# EAGLE design range_cape (EAGLE 7.3.0)

## Sheet 1 of 5
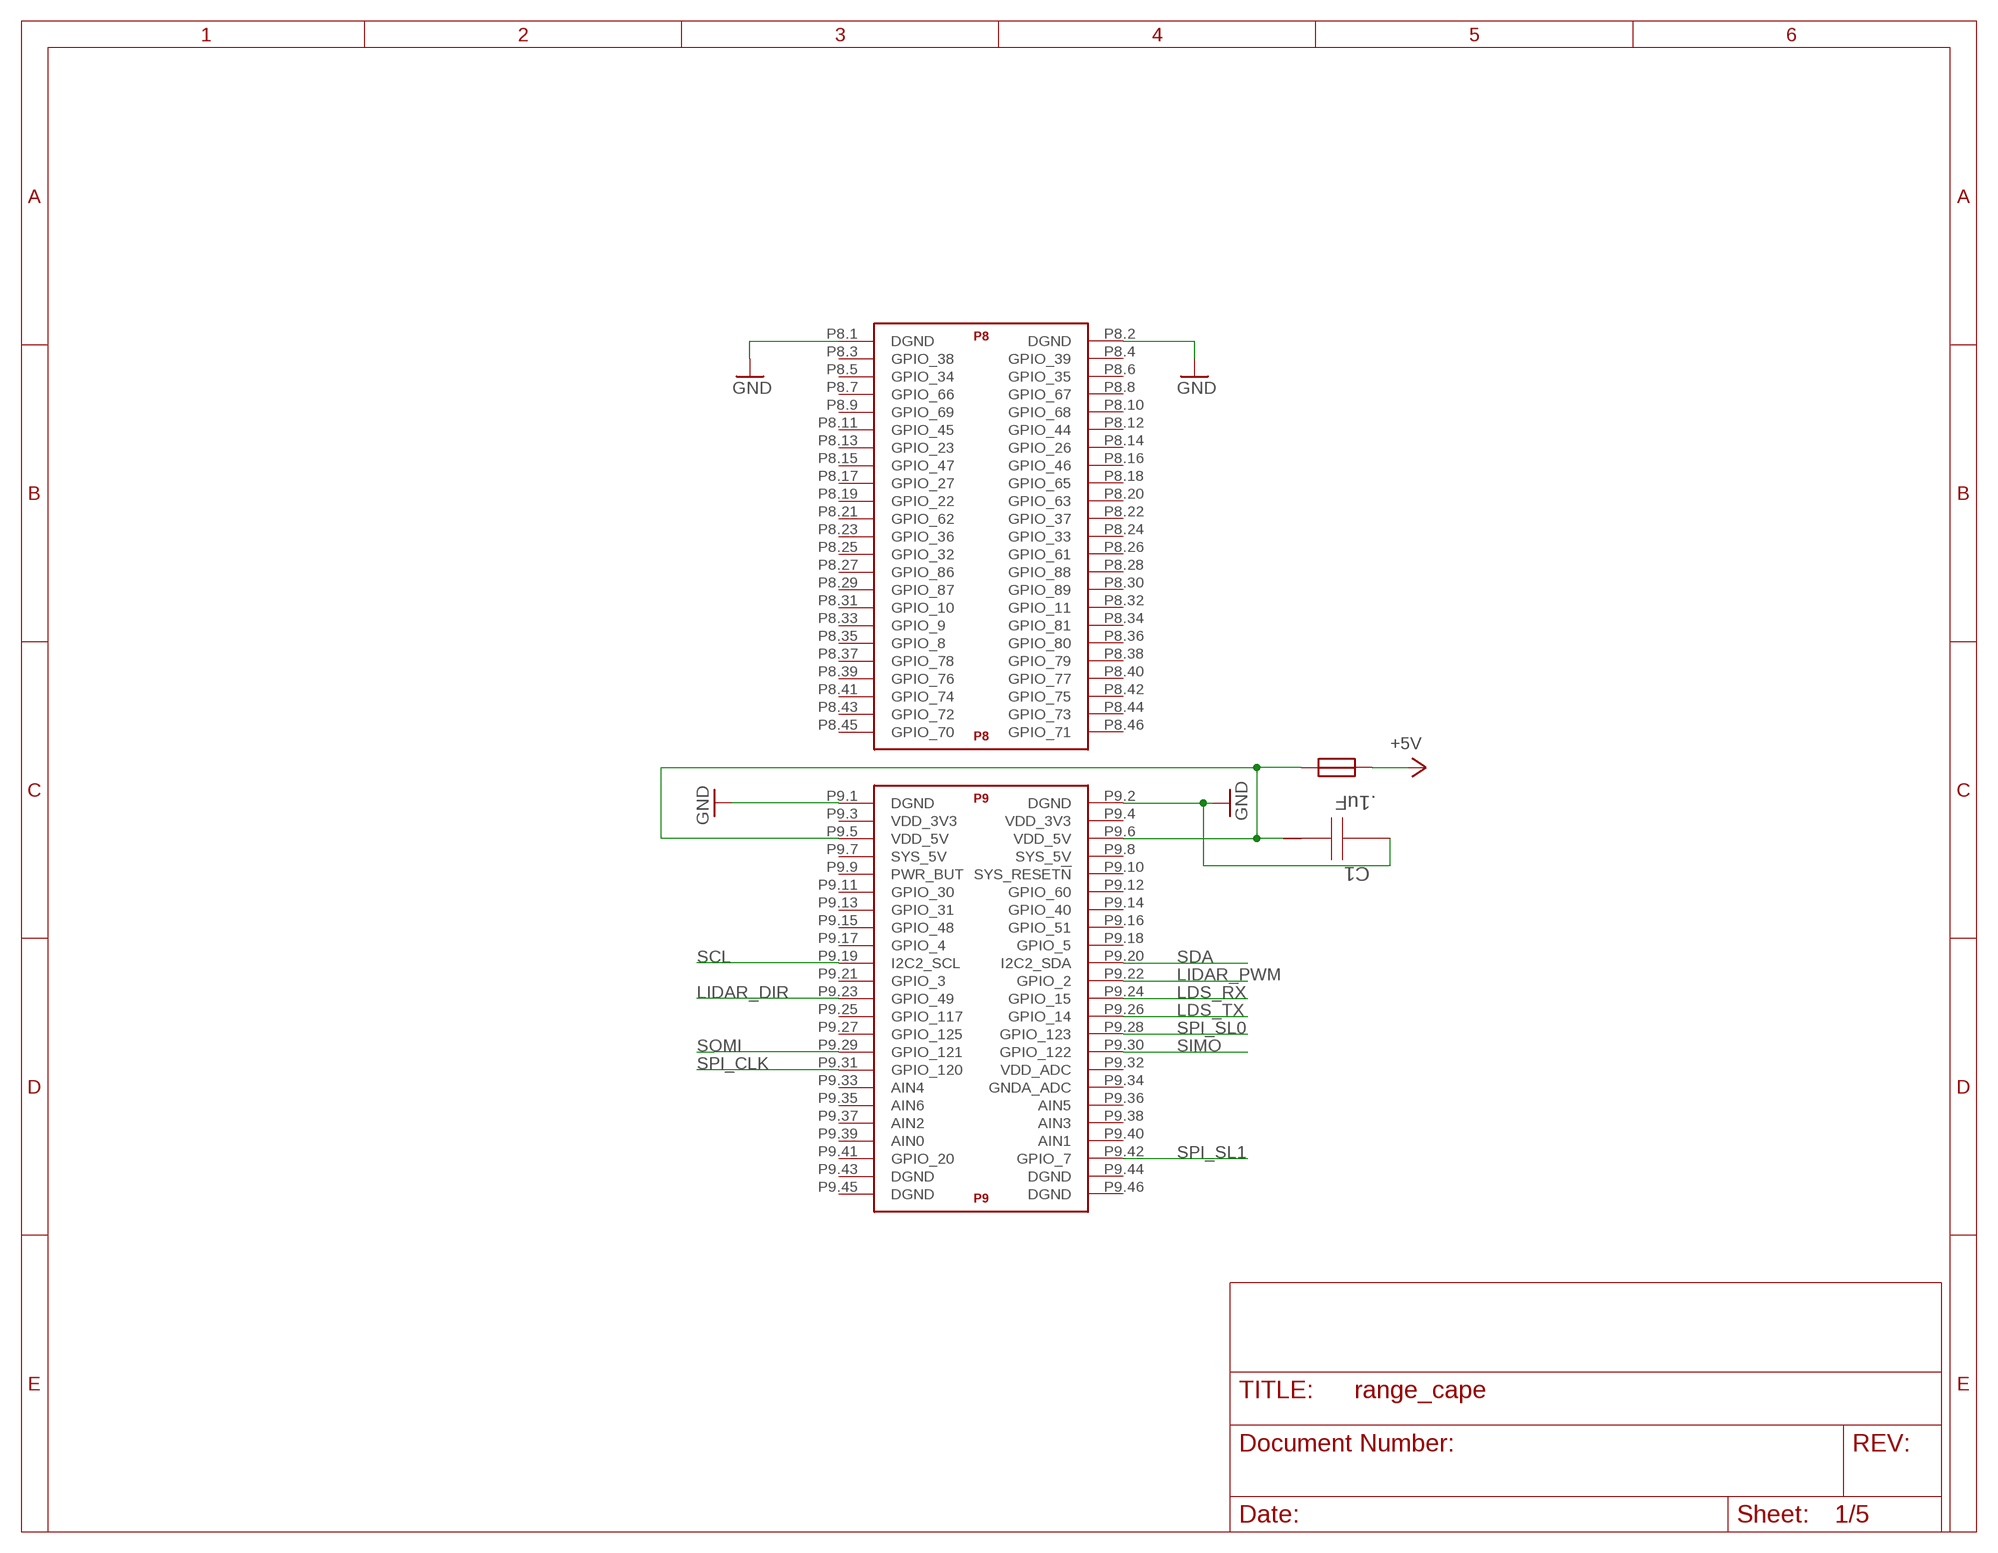
[diagram p0: schematic, sheet 1]

### Parts
C1  .1uF  C3216X5R1A106K  [1206]
U$1  BEAGLE_BONE_BLACK_CAPE  [BEAGLE_BONE_BLACK_CAPE]
U$11  NANO_FUSE  [NANO_FUSE]

### Nets
+5V: U$11.2 ; also sheet 3,4,5
GND: C1.2 U$1.P8.1(P8:DGND) U$1.P8.2(P8:DGND) U$1.P9.1(P9:DGND) U$1.P9.2(P9:DGND) ; also sheet 2,3,4,5
LDS_RX: U$1.P9.24(P9:GPIO_15) ; also sheet 4
LDS_TX: U$1.P9.26(P9:GPIO_14) ; also sheet 4
LIDAR_DIR: U$1.P9.23(P9:GPIO_49) ; also sheet 3
LIDAR_PWM: U$1.P9.22(P9:GPIO_2) ; also sheet 3
N$2: C1.1 U$1.P9.5(P9:VDD_5V) U$1.P9.6(P9:VDD_5V) U$11.1
SCL: U$1.P9.19(P9:I2C2_SCL) ; also sheet 4
SDA: U$1.P9.20(P9:I2C2_SDA) ; also sheet 4
SIMO: U$1.P9.30(P9:GPIO_122) ; also sheet 4
SOMI: U$1.P9.29(P9:GPIO_121) ; also sheet 4
SPI_CLK: U$1.P9.31(P9:GPIO_120) ; also sheet 2
SPI_SL0: U$1.P9.28(P9:GPIO_123) ; also sheet 4
SPI_SL1: U$1.P9.42(P9:GPIO_7) ; also sheet 4
Unconnected: U$1.P8.3(P8:GPIO_38) U$1.P8.4(P8:GPIO_39) U$1.P8.5(P8:GPIO_34) U$1.P8.6(P8:GPIO_35) U$1.P8.7(P8:GPIO_66) U$1.P8.8(P8:GPIO_67) U$1.P8.9(P8:GPIO_69) U$1.P8.10(P8:GPIO_68) U$1.P8.11(P8:GPIO_45) U$1.P8.12(P8:GPIO_44) U$1.P8.13(P8:GPIO_23) U$1.P8.14(P8:GPIO_26) U$1.P8.15(P8:GPIO_47) U$1.P8.16(P8:GPIO_46) U$1.P8.17(P8:GPIO_27) U$1.P8.18(P8:GPIO_65) U$1.P8.19(P8:GPIO_22) U$1.P8.20(P8:GPIO_63) U$1.P8.21(P8:GPIO_62) U$1.P8.22(P8:GPIO_37) U$1.P8.23(P8:GPIO_36) U$1.P8.24(P8:GPIO_33) U$1.P8.25(P8:GPIO_32) U$1.P8.26(P8:GPIO_61) U$1.P8.27(P8:GPIO_86) U$1.P8.28(P8:GPIO_88) U$1.P8.29(P8:GPIO_87) U$1.P8.30(P8:GPIO_89) U$1.P8.31(P8:GPIO_10) U$1.P8.32(P8:GPIO_11) U$1.P8.33(P8:GPIO_9) U$1.P8.34(P8:GPIO_81) U$1.P8.35(P8:GPIO_8) U$1.P8.36(P8:GPIO_80) U$1.P8.37(P8:GPIO_78) U$1.P8.38(P8:GPIO_79) U$1.P8.39(P8:GPIO_76) U$1.P8.40(P8:GPIO_77) U$1.P8.41(P8:GPIO_74) U$1.P8.42(P8:GPIO_75) U$1.P8.43(P8:GPIO_72) U$1.P8.44(P8:GPIO_73) U$1.P8.45(P8:GPIO_70) U$1.P8.46(P8:GPIO_71) U$1.P9.3(P9:VDD_3V3) U$1.P9.4(P9:VDD_3V3) U$1.P9.7(P9:SYS_5V) U$1.P9.8(P9:SYS_5V) U$1.P9.9(P9:PWR_BUT) U$1.P9.10(P9:SYS_RESET!N) U$1.P9.11(P9:GPIO_30) U$1.P9.12(P9:GPIO_60) U$1.P9.13(P9:GPIO_31) U$1.P9.14(P9:GPIO_40) U$1.P9.15(P9:GPIO_48) U$1.P9.16(P9:GPIO_51) U$1.P9.17(P9:GPIO_4) U$1.P9.18(P9:GPIO_5) U$1.P9.21(P9:GPIO_3) U$1.P9.25(P9:GPIO_117) U$1.P9.27(P9:GPIO_125) U$1.P9.32(P9:VDD_ADC) U$1.P9.33(P9:AIN4) U$1.P9.34(P9:GNDA_ADC) U$1.P9.35(P9:AIN6) U$1.P9.36(P9:AIN5) U$1.P9.37(P9:AIN2) U$1.P9.38(P9:AIN3) U$1.P9.39(P9:AIN0) U$1.P9.40(P9:AIN1) U$1.P9.41(P9:GPIO_20) U$1.P9.43(P9:DGND) U$1.P9.44(P9:DGND) U$1.P9.45(P9:DGND) U$1.P9.46(P9:DGND)

## Sheet 2 of 5
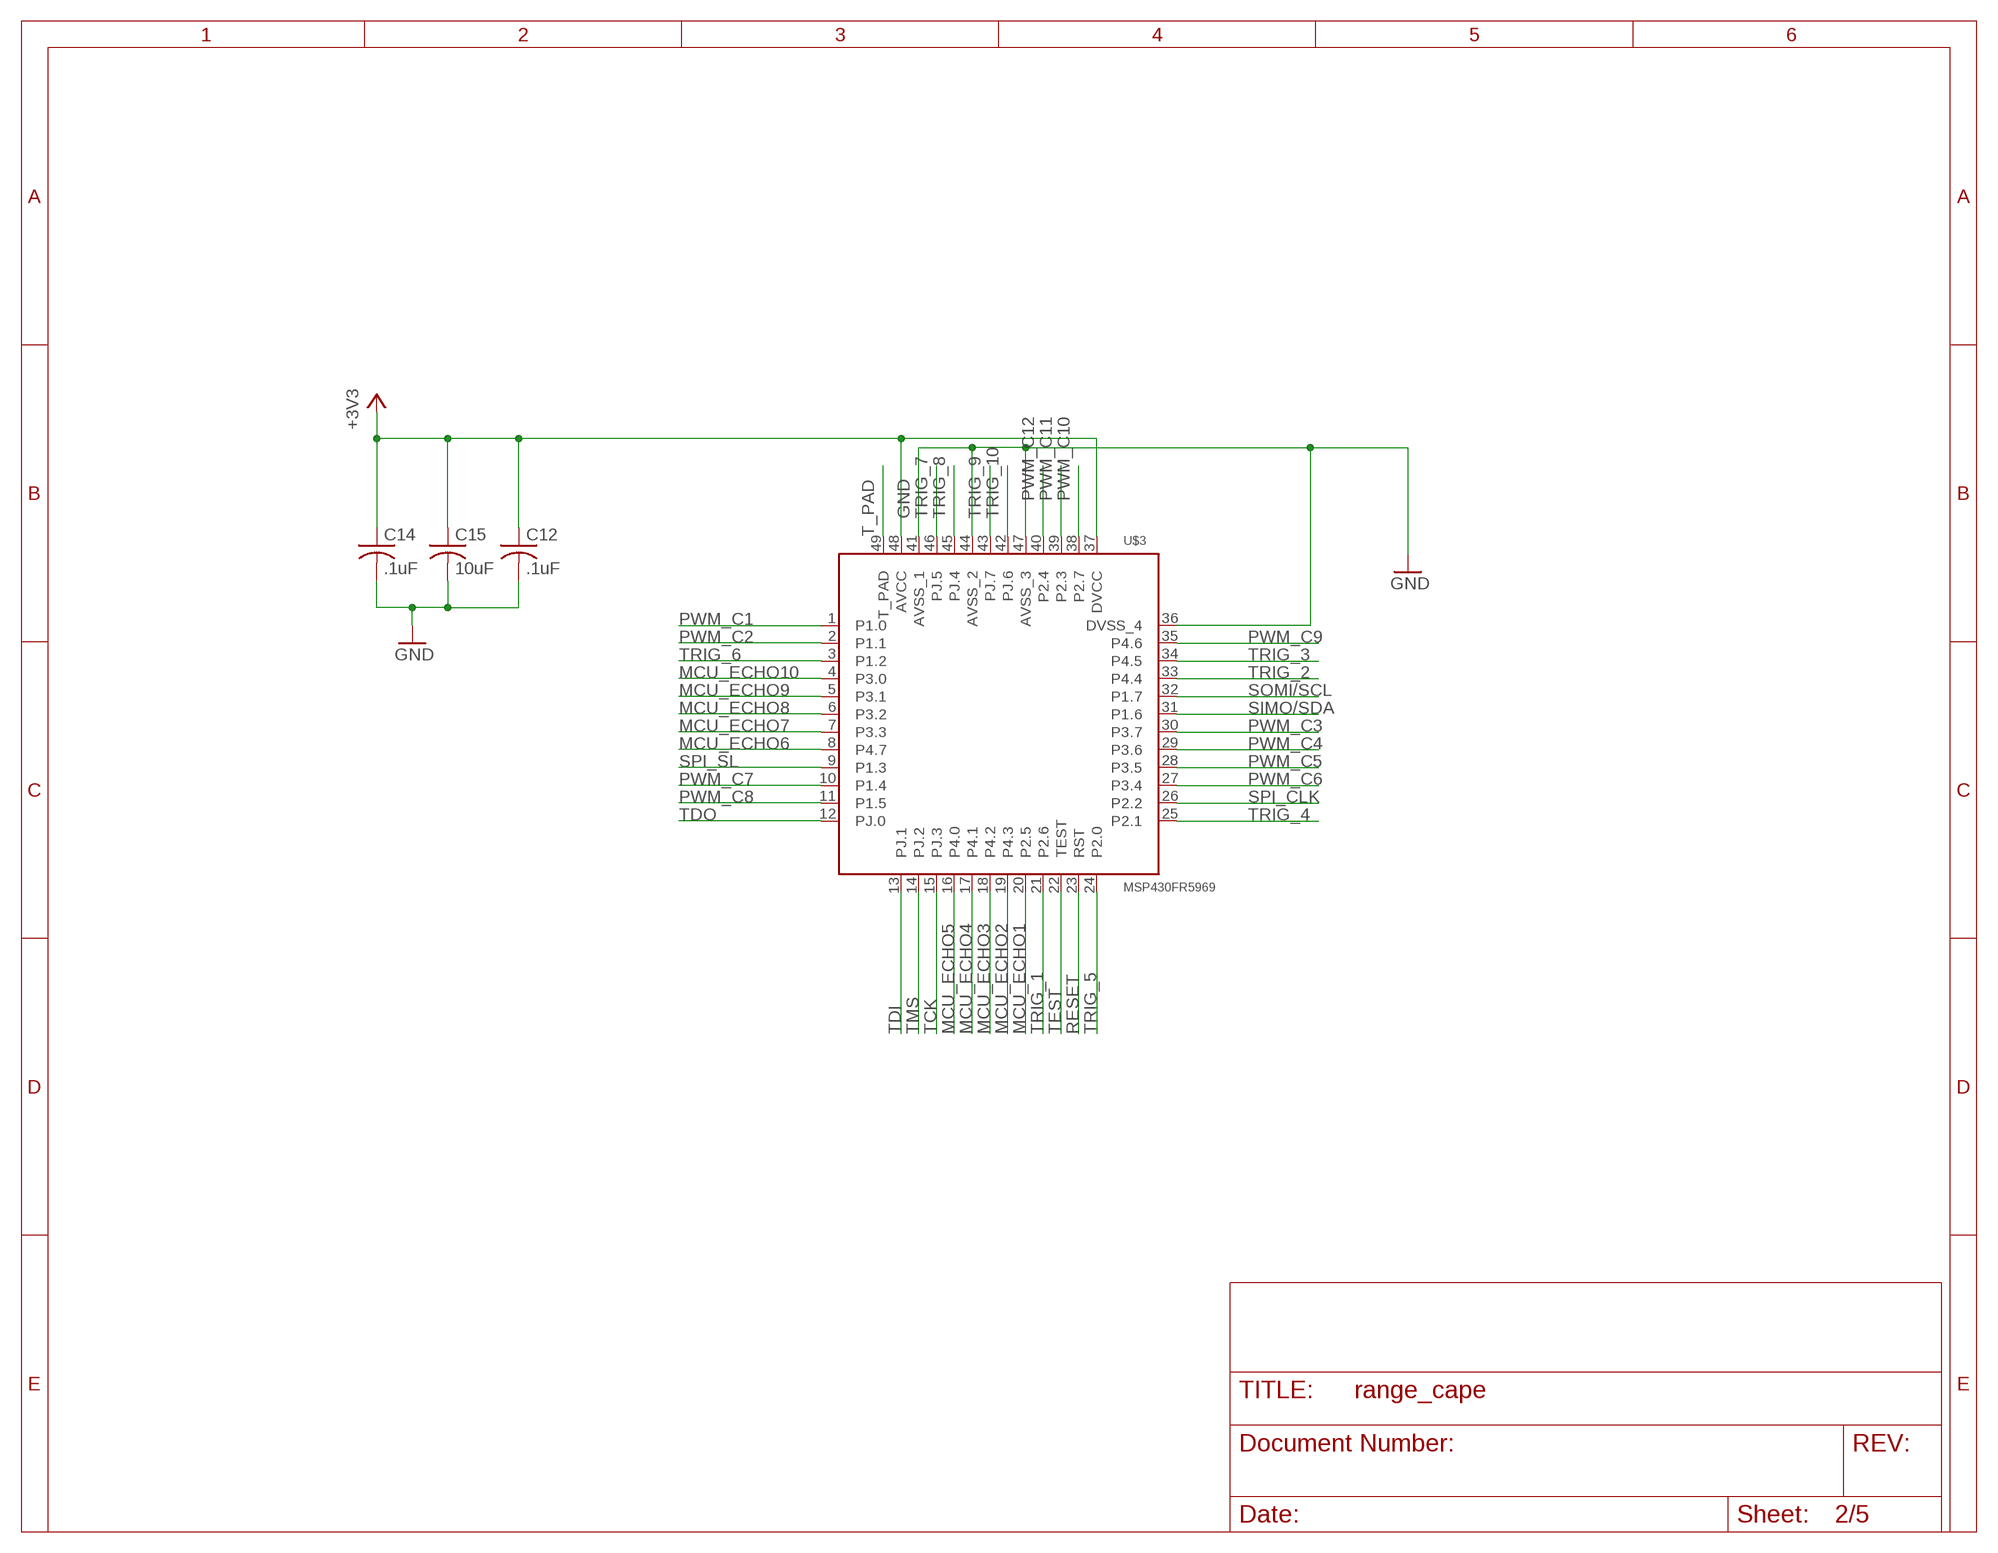
[diagram p1: schematic, sheet 2]

### Parts
C12  .1uF  C-USC0805  [C0805]
C14  .1uF  C-USC0805  [C0805]
C15  10uF  C-USC0805  [C0805]
U$3  MSP430FR5969  [QFN50P700X700X100-49N]

### Nets
+3V3: C12.1 C14.1 C15.1 U$3.37(DVCC) U$3.48(AVCC) ; also sheet 3,4,5
GND: C12.2 C14.2 C15.2 U$3.36(DVSS_4) U$3.41(AVSS_1) U$3.44(AVSS_2) U$3.47(AVSS_3) ; also sheet 1,3,4,5
MCU_ECHO1: U$3.20(P2.5) ; also sheet 3
MCU_ECHO2: U$3.19(P4.3) ; also sheet 3
MCU_ECHO3: U$3.18(P4.2) ; also sheet 3
MCU_ECHO4: U$3.17(P4.1) ; also sheet 3
MCU_ECHO5: U$3.16(P4.0) ; also sheet 3
MCU_ECHO6: U$3.8(P4.7) ; also sheet 3
MCU_ECHO7: U$3.7(P3.3) ; also sheet 3
MCU_ECHO8: U$3.6(P3.2) ; also sheet 3
MCU_ECHO9: U$3.5(P3.1) ; also sheet 3
MCU_ECHO10: U$3.4(P3.0) ; also sheet 3
PWM_C1: U$3.1(P1.0)
PWM_C2: U$3.2(P1.1)
PWM_C3: U$3.30(P3.7)
PWM_C4: U$3.29(P3.6)
PWM_C5: U$3.28(P3.5)
PWM_C6: U$3.27(P3.4)
PWM_C7: U$3.10(P1.4)
PWM_C8: U$3.11(P1.5)
PWM_C9: U$3.35(P4.6)
PWM_C10: U$3.38(P2.7)
PWM_C11: U$3.39(P2.3)
PWM_C12: U$3.40(P2.4)
RESET: U$3.23(RST) ; also sheet 3
SIMO/SDA: U$3.31(P1.6) ; also sheet 4
SOMI/SCL: U$3.32(P1.7) ; also sheet 4
SPI_CLK: U$3.26(P2.2) ; also sheet 1
SPI_SL: U$3.9(P1.3) ; also sheet 4
T_PAD: U$3.49(T_PAD)
TCK: U$3.15(PJ.3) ; also sheet 3
TDI: U$3.13(PJ.1) ; also sheet 3
TDO: U$3.12(PJ.0) ; also sheet 3
TEST: U$3.22(TEST) ; also sheet 3
TMS: U$3.14(PJ.2) ; also sheet 3
TRIG_1: U$3.21(P2.6) ; also sheet 4
TRIG_2: U$3.33(P4.4) ; also sheet 4
TRIG_3: U$3.34(P4.5) ; also sheet 4
TRIG_4: U$3.25(P2.1) ; also sheet 4
TRIG_5: U$3.24(P2.0) ; also sheet 4
TRIG_6: U$3.3(P1.2) ; also sheet 4
TRIG_7: U$3.46(PJ.5) ; also sheet 4
TRIG_8: U$3.45(PJ.4) ; also sheet 4
TRIG_9: U$3.43(PJ.7) ; also sheet 4
TRIG_10: U$3.42(PJ.6) ; also sheet 4

## Sheet 3 of 5
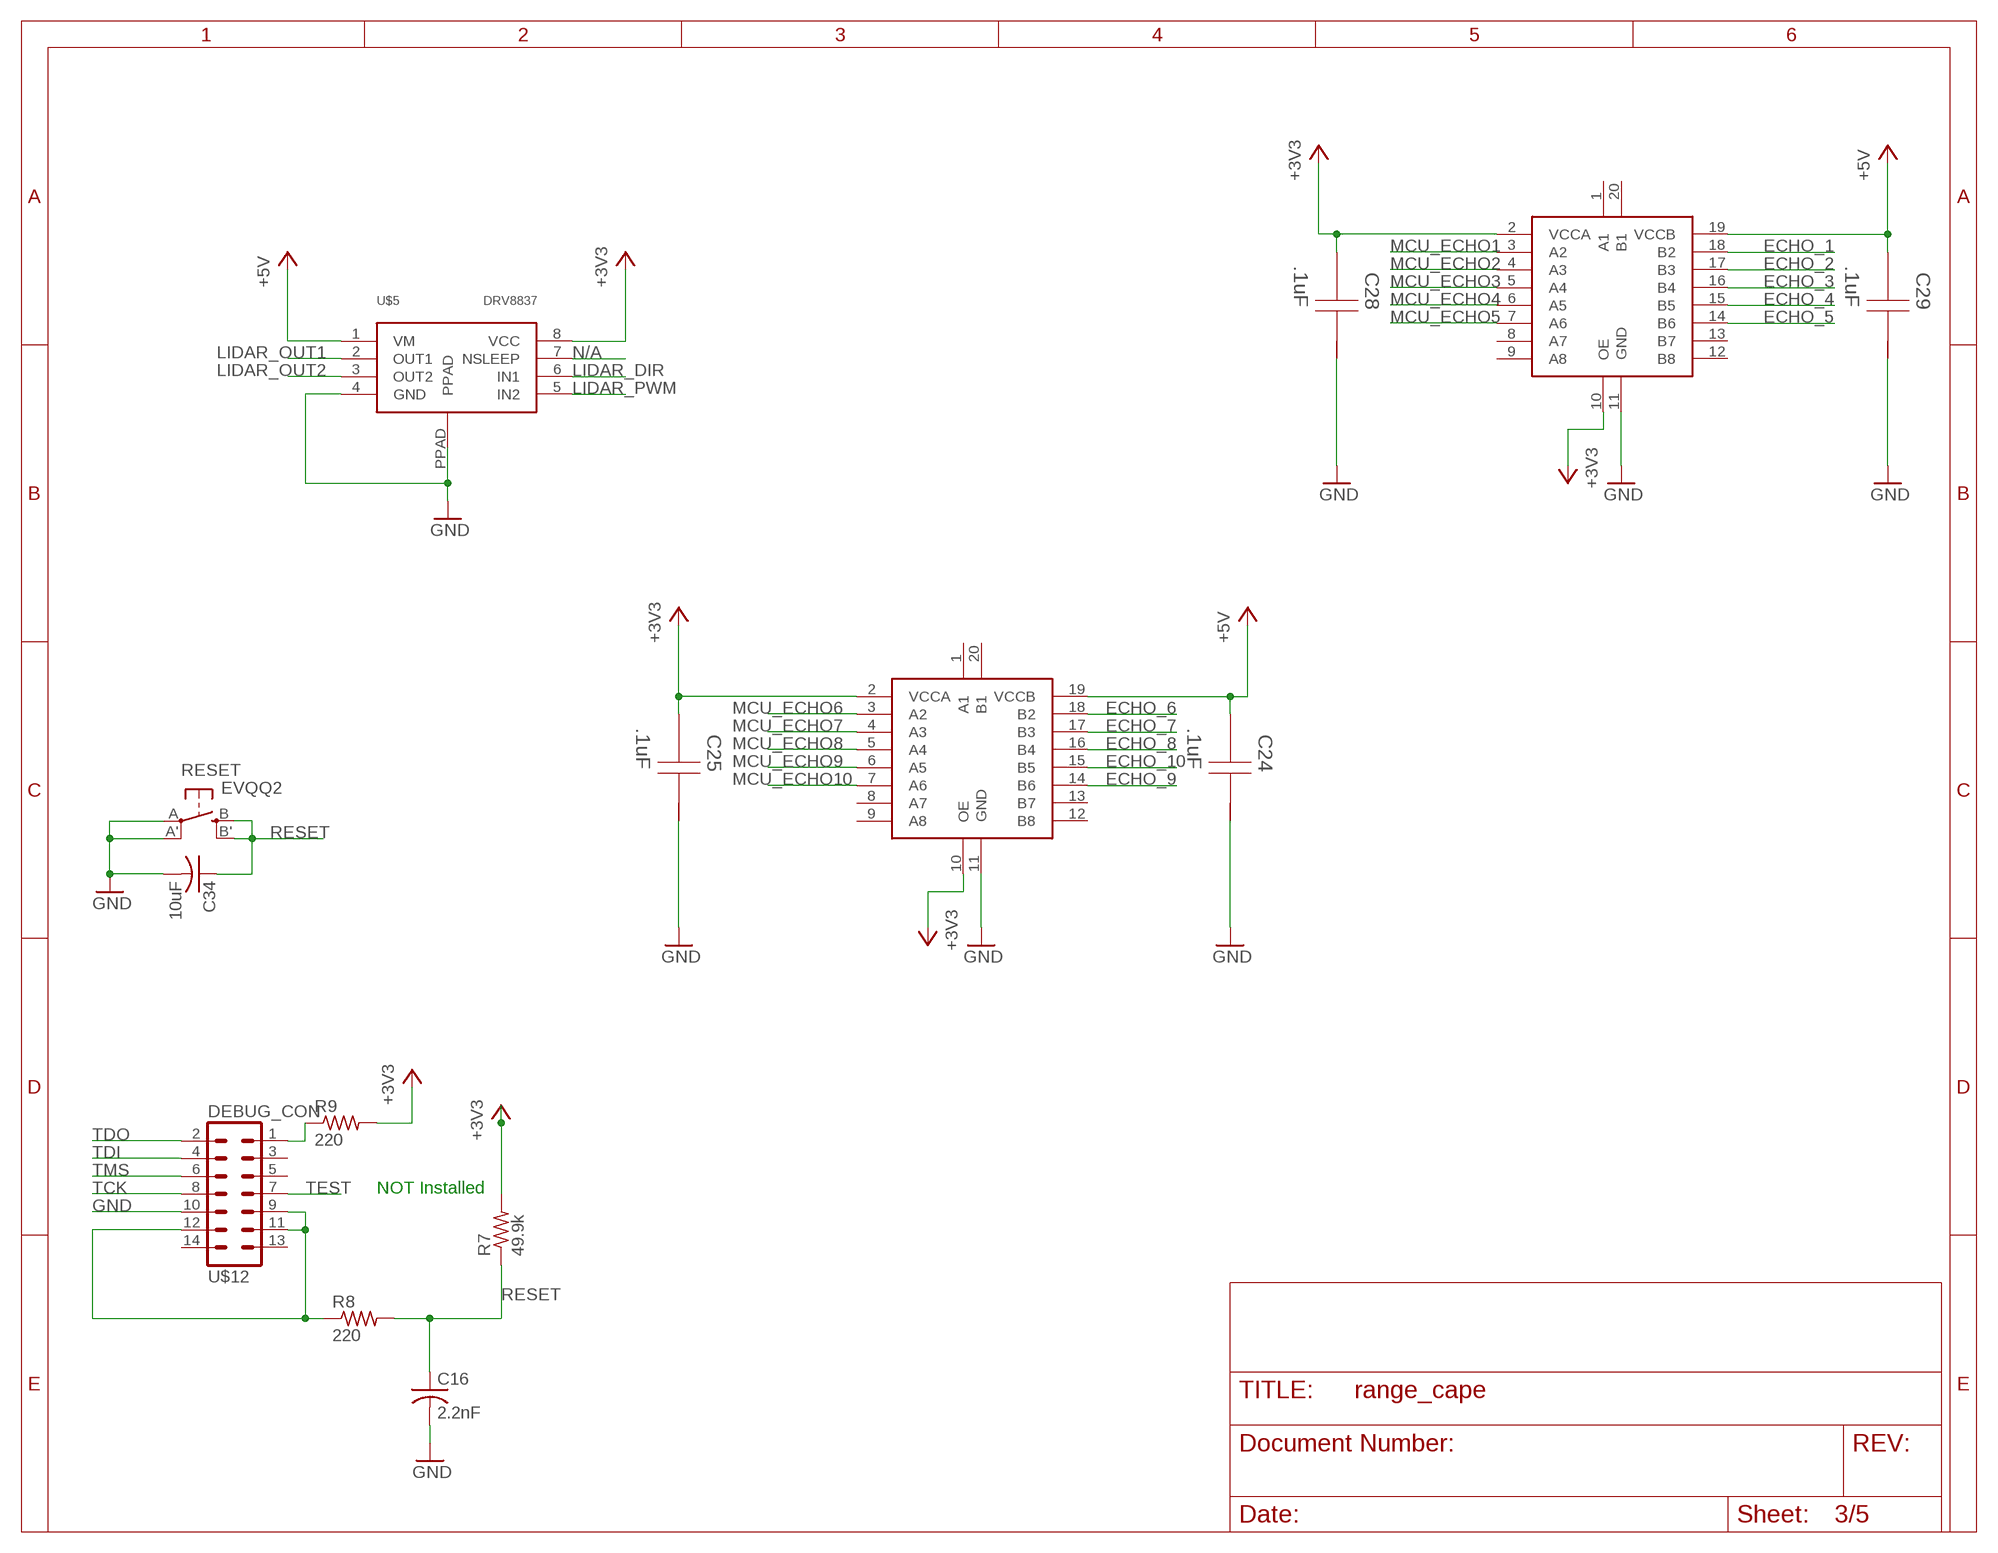
[diagram p2: schematic, sheet 3]

### Parts
C16  2.2nF  C-USC0603  [C0603]
C24  .1uF  C3216X5R1A106K  [1206]
C25  .1uF  C3216X5R1A106K  [1206]
C28  .1uF  C3216X5R1A106K  [1206]
C29  .1uF  C3216X5R1A106K  [1206]
C34  10uF  C-USC1206  [C1206]
R7  49.9k  R-US_R0603  [R0603]
R8  220  R-US_R0603  [R0603]
R9  220  R-US_R0603  [R0603]
RESET  EVQQ2  [EVQ-Q2]
U$5  DRV8837  [WSON-8]
U$6  TXB0108  [TSSOP-20]
U$8  TXB0108  [TSSOP-20]
U$12  DEBUG_CON  [DEBUG_SM]

### Nets
+3V3: C25.2 C28.2 R7.2 R9.2 U$5.8(VCC) U$6.2(VCCA) U$6.10(OE) U$8.2(VCCA) U$8.10(OE) ; also sheet 2,4,5
+5V: C24.2 C29.2 U$5.1(VM) U$6.19(VCCB) U$8.19(VCCB) ; also sheet 1,4,5
ECHO_1: U$6.18(B2) ; also sheet 4
ECHO_2: U$6.17(B3) ; also sheet 4
ECHO_3: U$6.16(B4) ; also sheet 4
ECHO_4: U$6.15(B5) ; also sheet 4
ECHO_5: U$6.14(B6) ; also sheet 4
ECHO_6: U$8.18(B2) ; also sheet 4
ECHO_7: U$8.17(B3) ; also sheet 4
ECHO_8: U$8.16(B4) ; also sheet 4
ECHO_9: U$8.14(B6) ; also sheet 4
ECHO_10: U$8.15(B5) ; also sheet 4
GND: C16.2 C24.1 C25.1 C28.1 C29.1 C34.2 RESET.A'(P1) RESET.A(P) U$5.4(GND) U$5.PPAD U$6.11(GND) U$8.11(GND) U$12.10 ; also sheet 1,2,4,5
LIDAR_DIR: U$5.6(IN1) ; also sheet 1
LIDAR_OUT1: U$5.2(OUT1) ; also sheet 4
LIDAR_OUT2: U$5.3(OUT2) ; also sheet 4
LIDAR_PWM: U$5.5(IN2) ; also sheet 1
MCU_ECHO1: U$6.3(A2) ; also sheet 2
MCU_ECHO2: U$6.4(A3) ; also sheet 2
MCU_ECHO3: U$6.5(A4) ; also sheet 2
MCU_ECHO4: U$6.6(A5) ; also sheet 2
MCU_ECHO5: U$6.7(A6) ; also sheet 2
MCU_ECHO6: U$8.3(A2) ; also sheet 2
MCU_ECHO7: U$8.4(A3) ; also sheet 2
MCU_ECHO8: U$8.5(A4) ; also sheet 2
MCU_ECHO9: U$8.6(A5) ; also sheet 2
MCU_ECHO10: U$8.7(A6) ; also sheet 2
N$8: R8.1 U$12.9 U$12.11 U$12.12
N$9: R9.1 U$12.1
N/A: U$5.7(NSLEEP)
RESET: C16.1 C34.1 R7.1 R8.2 RESET.B'(S1) RESET.B(S) ; also sheet 2
TCK: U$12.8 ; also sheet 2
TDI: U$12.4 ; also sheet 2
TDO: U$12.2 ; also sheet 2
TEST: U$12.7 ; also sheet 2
TMS: U$12.6 ; also sheet 2
Unconnected: U$6.1(A1) U$6.8(A7) U$6.9(A8) U$6.12(B8) U$6.13(B7) U$6.20(B1) U$8.1(A1) U$8.8(A7) U$8.9(A8) U$8.12(B8) U$8.13(B7) U$8.20(B1) U$12.3 U$12.5 U$12.13 U$12.14

### Notes on the sheet
- NOT Installed

## Sheet 4 of 5
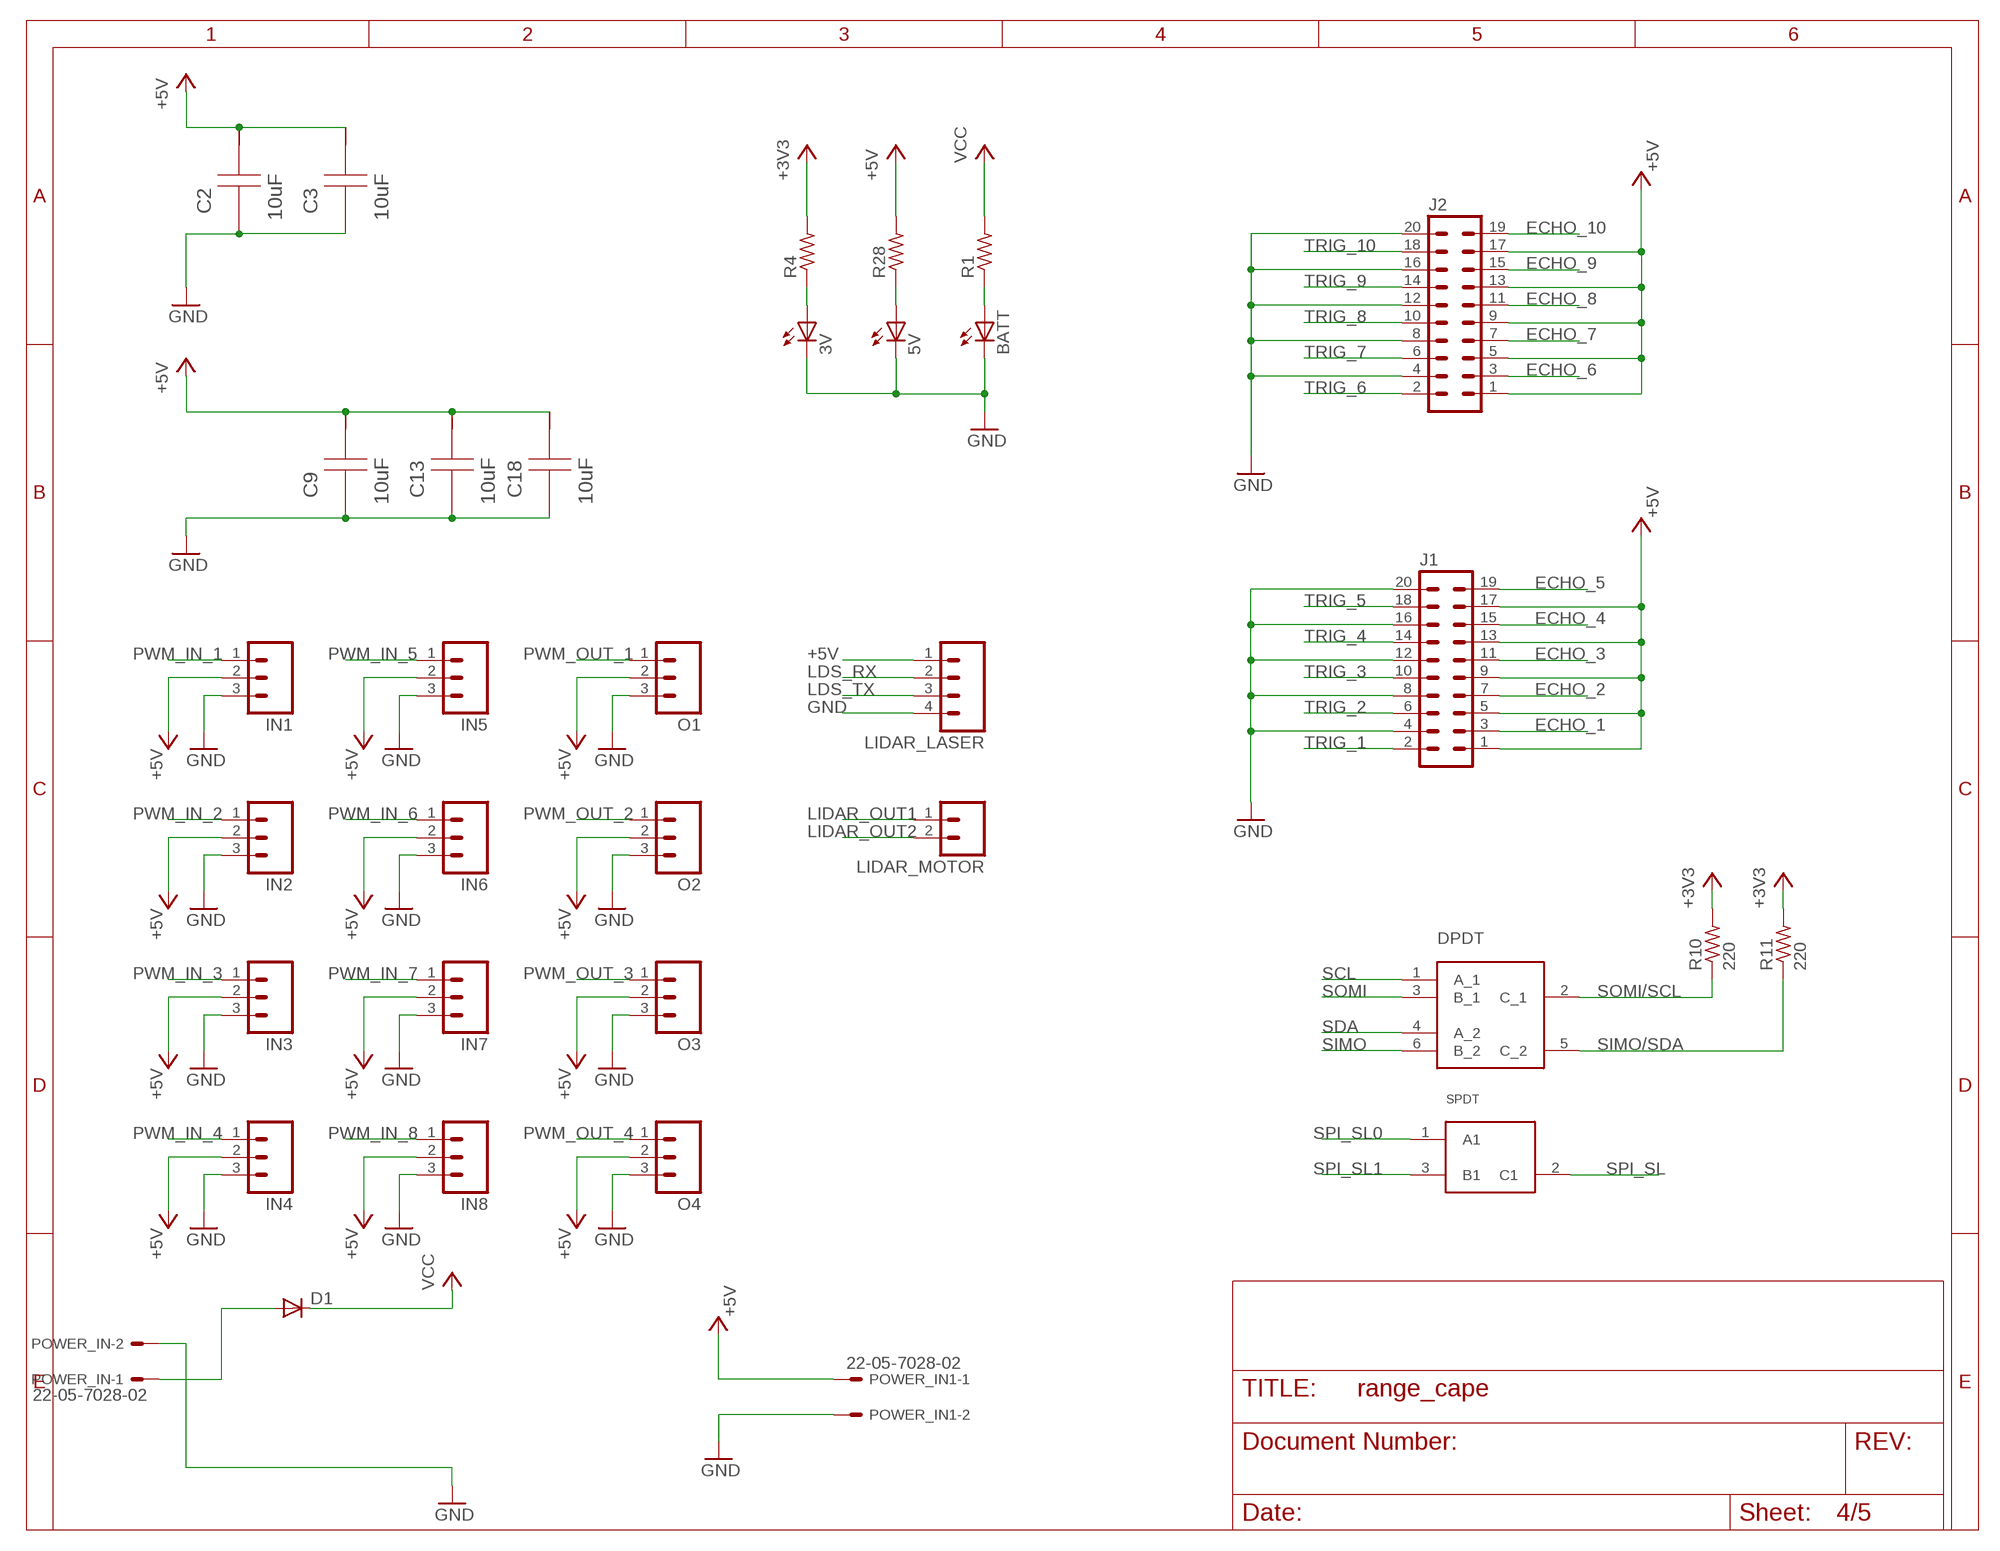
[diagram p3: schematic, sheet 4]

### Parts
3V  LED_ESML0603  [LED_SML0603]
5V  LED_ESML0603  [LED_SML0603]
BATT  LED_ESML0603  [LED_SML0603]
C2  10uF  C3216X5R1A106K  [1206]
C3  10uF  C3216X5R1A106K  [1206]
C9  10uF  C3216X5R1A106K  [1206]
C13  10uF  C3216X5R1A106K  [1206]
C18  10uF  C3216X5R1A106K  [1206]
D1  DIODE-DO-214AC  [DO-214AC]
IN1  M03LOCK  [1X03_LOCK]
IN2  M03LOCK  [1X03_LOCK]
IN3  M03LOCK  [1X03_LOCK]
IN4  M03LOCK  [1X03_LOCK]
IN5  M03LOCK  [1X03_LOCK]
IN6  M03LOCK  [1X03_LOCK]
IN7  M03LOCK  [1X03_LOCK]
IN8  M03LOCK  [1X03_LOCK]
J1  MA10-2  [MA10-2]
J2  MA10-2  [MA10-2]
LIDAR_LASER  M04JST-PTH-VERT  [JST-4-PTH-VERT]
LIDAR_MOTOR  M02JST-PTH-VERT  [JST-2-PTH-VERT]
O1  M03LOCK  [1X03_LOCK]
O2  M03LOCK  [1X03_LOCK]
O3  M03LOCK  [1X03_LOCK]
O4  M03LOCK  [1X03_LOCK]
POWER_IN  22-05-7028-02  [7395-02]
POWER_IN1  22-05-7028-02  [7395-02]
R1  R-US_R0603  [R0603]
R4  R-US_R0603  [R0603]
R10  220  R-US_R0402  [R0402]
R11  220  R-US_R0402  [R0402]
R28  R-US_R0603  [R0603]
SPDT  SPDT_SWITCH  [SPDT]
U$4  DPDT_I2C_SPI  [DPDT]

### Nets
+3V3: R4.2 R10.2 R11.2 ; also sheet 2,3,5
+5V: C2.1 C3.1 C9.1 C13.1 C18.1 IN1.2 IN2.2 IN3.2 IN4.2 IN5.2 IN6.2 IN7.2 IN8.2 J1.1 J1.5 J1.9 J1.13 J1.17 J2.1 J2.5 J2.9 J2.13 J2.17 LIDAR_LASER.1 O1.2 O2.2 O3.2 O4.2 POWER_IN1.1 R28.2 ; also sheet 1,3,5
ECHO_1: J1.3 ; also sheet 3
ECHO_2: J1.7 ; also sheet 3
ECHO_3: J1.11 ; also sheet 3
ECHO_4: J1.15 ; also sheet 3
ECHO_5: J1.19 ; also sheet 3
ECHO_6: J2.3 ; also sheet 3
ECHO_7: J2.7 ; also sheet 3
ECHO_8: J2.11 ; also sheet 3
ECHO_9: J2.15 ; also sheet 3
ECHO_10: J2.19 ; also sheet 3
GND: 3V.C 5V.C BATT.C C2.2 C3.2 C9.2 C13.2 C18.2 IN1.3 IN2.3 IN3.3 IN4.3 IN5.3 IN6.3 IN7.3 IN8.3 J1.4 J1.8 J1.12 J1.16 J1.20 J2.4 J2.8 J2.12 J2.16 J2.20 LIDAR_LASER.4 O1.3 O2.3 O3.3 O4.3 POWER_IN1.2 POWER_IN.2 ; also sheet 1,2,3,5
LDS_RX: LIDAR_LASER.2 ; also sheet 1
LDS_TX: LIDAR_LASER.3 ; also sheet 1
LIDAR_OUT1: LIDAR_MOTOR.1 ; also sheet 3
LIDAR_OUT2: LIDAR_MOTOR.2 ; also sheet 3
N$3: D1.A POWER_IN.1
N$4: BATT.A R1.1
N$5: 3V.A R4.1
N$10: 5V.A R28.1
PWM_IN_1: IN1.1
PWM_IN_2: IN2.1
PWM_IN_3: IN3.1
PWM_IN_4: IN4.1
PWM_IN_5: IN5.1
PWM_IN_6: IN6.1
PWM_IN_7: IN7.1
PWM_IN_8: IN8.1
PWM_OUT_1: O1.1
PWM_OUT_2: O2.1
PWM_OUT_3: O3.1
PWM_OUT_4: O4.1
SCL: U$4.1(A_1) ; also sheet 1
SDA: U$4.4(A_2) ; also sheet 1
SIMO: U$4.6(B_2) ; also sheet 1
SIMO/SDA: R11.1 U$4.5(C_2) ; also sheet 2
SOMI: U$4.3(B_1) ; also sheet 1
SOMI/SCL: R10.1 U$4.2(C_1) ; also sheet 2
SPI_SL: SPDT.2(C1) ; also sheet 2
SPI_SL0: SPDT.1(A1) ; also sheet 1
SPI_SL1: SPDT.3(B1) ; also sheet 1
TRIG_1: J1.2 ; also sheet 2
TRIG_2: J1.6 ; also sheet 2
TRIG_3: J1.10 ; also sheet 2
TRIG_4: J1.14 ; also sheet 2
TRIG_5: J1.18 ; also sheet 2
TRIG_6: J2.2 ; also sheet 2
TRIG_7: J2.6 ; also sheet 2
TRIG_8: J2.10 ; also sheet 2
TRIG_9: J2.14 ; also sheet 2
TRIG_10: J2.18 ; also sheet 2
VCC: D1.C R1.2 ; also sheet 5

## Sheet 5 of 5
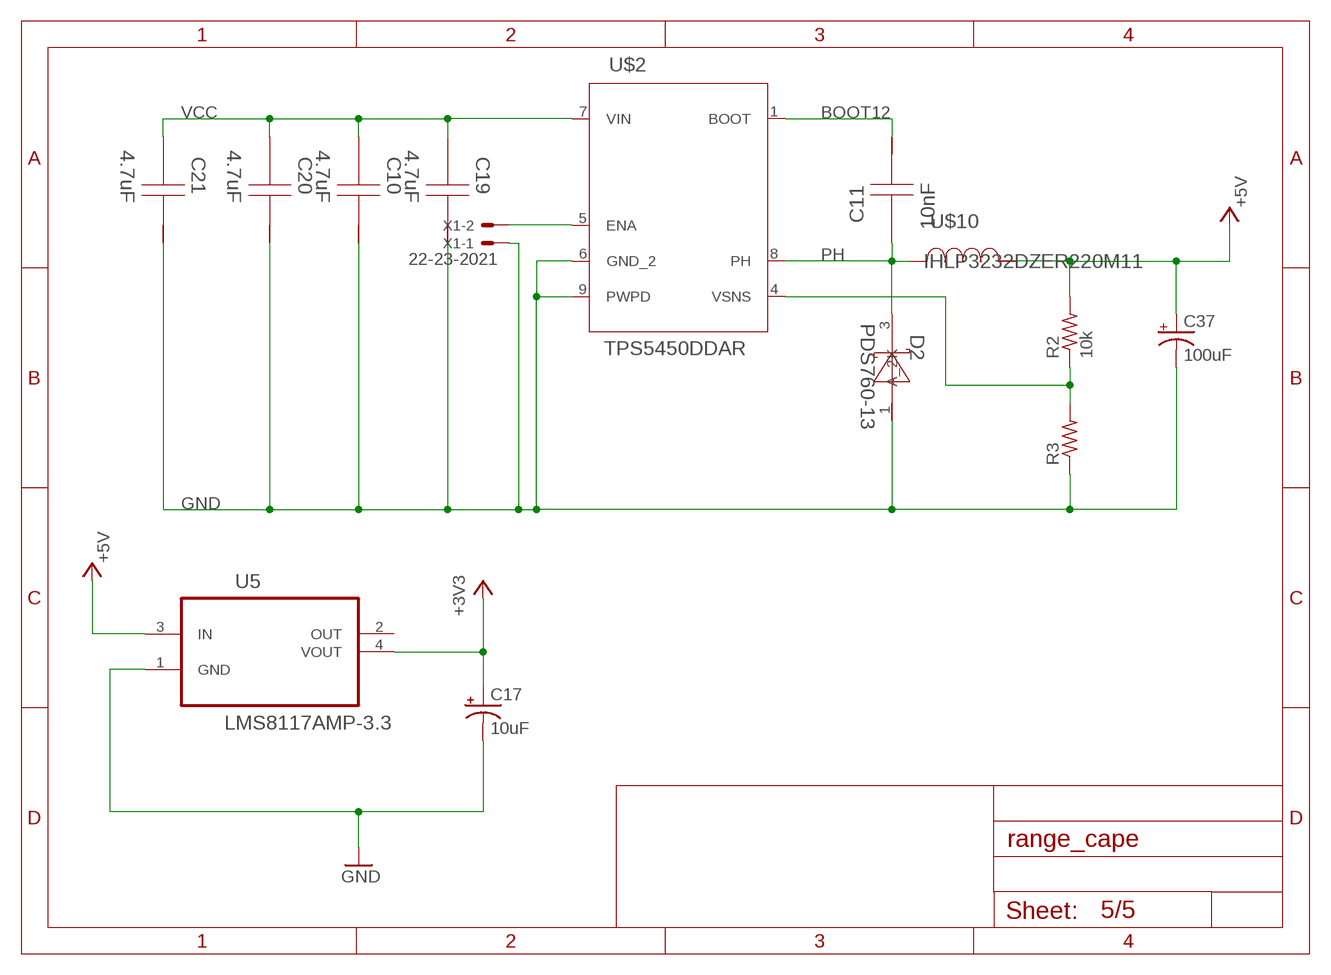
[diagram p4: schematic, sheet 5]

### Parts
C10  4.7uF  GRM31CR71H475KA12L  [1206]
C11  10nF  C0805C103K5RACTU  [0805]
C17  10uF  10UF-16V-10%(TANT)  [EIA3216]
C19  4.7uF  GRM31CR71H475KA12L  [1206]
C20  4.7uF  GRM31CR71H475KA12L  [1206]
C21  4.7uF  GRM31CR71H475KA12L  [1206]
C37  100uF  100UF-10V-10%(TANT)  [EIA7343]
D2  PDS760-13  [POWERDI5]
R2  10k  R-US_M0805  [M0805]
R3  R-US_M0805  [M0805]
U5  LMS8117AMP-3.3  [SOT230P696X180-4N]
U$2  TPS5450DDAR  [R-PDSO-G8]
U$10  IHLP3232DZER220M11  [IHLP-3232DZ]
X1  22-23-2021  [22-23-2021]

### Nets
+3V3: C17.A(+) U5.4(VOUT) ; also sheet 2,3,4
+5V: C37.A(+) R2.2 U5.3(IN) U$10.2 ; also sheet 1,3,4
BOOT12: C11.1 U$2.1(BOOT)
GND: C10.1 C17.C(-) C19.1 C20.1 C21.1 C37.C(-) D2.1(A_2) R3.1 U5.1(GND) U$2.6(GND_2) U$2.9(PWPD) X1.1 ; also sheet 1,2,3,4
N$1: U$2.5(ENA) X1.2
PH: C11.2 D2.3(K) U$2.8(PH) U$10.1
VCC: C10.2 C19.2 C20.2 C21.2 U$2.7(VIN) ; also sheet 4
VSNS12: R2.1 R3.2 U$2.4(VSNS)
Unconnected: U5.2(OUT)

## Library data of the parts
3V 5V BATT = eagle-ltspice:LED_E: LED Source: http://www.osram.convergy.de Source: www.luxeon.com Source: www.kingbright.com; SPICEMODEL: NONE; SPICEPREFIX: D; SPICETYPE: diode
C1-C3 C9 C13 C18 C24 C25 C28 C29 = 3-3_fixed:C3216X5R1A106K; CAP: 1.0E-5; DATASHEETURL: http://www.tdk.co.jp/tefe02/e3999%5Fc.pdf; ESR: 0.00306; IRMS: 0.0; MANUFACTURER_PART_NUMBER: C3216X5R1A106K; VDC: 10.0; VENDOR: TDK
C10 C19-C21 = 5v:GRM31CR71H475KA12L; CAP: 4.7E-6; ESR: 0.0; IRMS: 0.0; MANUFACTURER_NAME: MuRata; MANUFACTURER_PART_NUMBER: GRM31CR71H475KA12L; VDC: 50.0; VENDOR: MuRata
C11 = 5v:C0805C103K5RACTU; CAP: 1.0E-8; ESR: 1.739; IRMS: 0.411; MANUFACTURER_NAME: Kemet; MANUFACTURER_PART_NUMBER: C0805C103K5RACTU; VDC: 50.0; VENDOR: Kemet
C12 C14-C16 C34 = rcl:C-US: CAPACITOR, American symbol
C17 = SparkFun-Capacitors:10UF-16V-10%(TANT): CAP-00811 1206/EIA-3216 Tantalum capacitor; PROD_ID: CAP-00811
C37 = SparkFun-Capacitors:100UF-10V-10%(TANT): CAP-07890; PROD_ID: CAP-07890
D1 = diode:DIODE-: DIODE
D2 = 5v:PDS760-13; DATASHEETURL: www.diodes.com/datasheets/ds30477.pdf; IO: 7.0; MANUFACTURER_NAME: Diodes Inc.; MANUFACTURER_PART_NUMBER: PDS760-13; VENDOR: Diodes Inc.; VFATIO: 0.56; VRRM: 60.0
IN1-IN8 O1-O4 = SparkFun-Connectors:M03: Header 3 Standard 3-pin 0.1" header. Use with straight break away headers (SKU : PRT-00116), right angle break away headers (PRT-00553), swiss pins (PRT-00743), machine pins (PRT-00117), and female headers (PRT-00115). Molex polarized connector foot print use with SKU : PRT-08232 with associated crimp pins and housings.
J1 J2 = con-lstb:MA10-2: PIN HEADER; OC_FARNELL: unknown; OC_NEWARK: unknown
LIDAR_LASER = SparkFun-Connectors:M04: Header 4 Standard 4-pin 0.1" header. Use with straight break away headers (SKU : PRT-00116), right angle break away headers (PRT-00553), swiss pins (PRT-00743), machine pins (PRT-00117), and female headers (PRT-00115). Molex polarized connector foot print use with SKU : PRT-08231 with associated crimp pins and housings. 1MM SMD Version SKU: PRT-10208
LIDAR_MOTOR = SparkFun-Connectors:M02: Standard 2-pin 0.1" header. Use with - straight break away headers ( PRT-00116) - right angle break away headers (PRT-00553) - swiss pins (PRT-00743) - machine pins (PRT-00117) - female headers (PRT-00115) Molex polarized connector foot print use with: PRT-08233 with associated crimp pins and housings. 2.54_SCREWTERM for use with PRT-10571. 3.5mm Screw Terminal footprints for PRT-08084 5mm Screw Terminal footprints for use with PRT-08432
POWER_IN POWER_IN1 = con-molex:22-?-02: CONNECTOR wire to board 2.54 mm (.1 inch) pitch header; OC_FARNELL: 9731601; OC_NEWARK: unknown
R1 R4 R7-R11 R28 = rcl:R-US_: RESISTOR, American symbol
R2 R3 = range_cape:R-US_: RESISTOR, American symbol
RESET = adafruit:EVQQ2: SMT 6mm switch, EVQQ2 series http://www.ladyada.net/library/eagle
SPDT = range_cape:SPDT_SWITCH
U5 = NSC-LMS8117AMP:LMS8117AMP-3.3: Low-Dropout Linear Regulator; MPN: LMS8117AMP-3.3; OC_FARNELL: 1469032; OC_NEWARK: 41K3020; PACKAGE: SOT-223-3; SUPPLIER: National Semiconductor
U$1 = SparkFun-Boards:BEAGLE_BONE_BLACK_CAPE
U$2 = 5v:TPS5450DDAR; DATASHEETURL: http://www.ti.com/product/tps5450; FREQUENCY: 500000.0; IMAX: 5.0; MANUFACTURER_NAME: Texas Instruments; MANUFACTURER_PART_NUMBER: TPS5450DDA; MKTG_PACKAGE: TPS5450; NSID: TPS5450DDAR; PACKAGE: TPS5450; VENDOR: Texas Instruments
U$3 = range_cape:MSP430FR5969
U$4 = range_cape:DPDT_I2C_SPI
U$5 = range_cape:DRV8837
U$6 U$8 = range_cape:TXB0108
U$10 = tps5450:IHLP3232DZER220M11; DATASHEETURL: http://www.vishay.com/docs/34313/ihlp3232dz11.pdf; DCR: 94.2; DESCRIPTION: Unknown; IDC: 3.3; L: 2.2E-5; MANUFACTURER: Vishay; MANUFACTURER_NAME: Vishay-Dale; MANUFACTURER_PART_NUMBER: IHLP3232DZER220M11; PACKAGE_DESIGNATOR: IHLP-3232DZ; VENDOR: Vishay-Dale
U$11 = custom_fuses:NANO_FUSE
U$12 = range_cape:DEBUG_CON
X1 = con-molex:22-23-2021: .100" (2.54mm) Center Header - 2 Pin; MF: MOLEX; MPN: 22-23-2021; OC_FARNELL: 1462926; OC_NEWARK: 25C3832

## Board
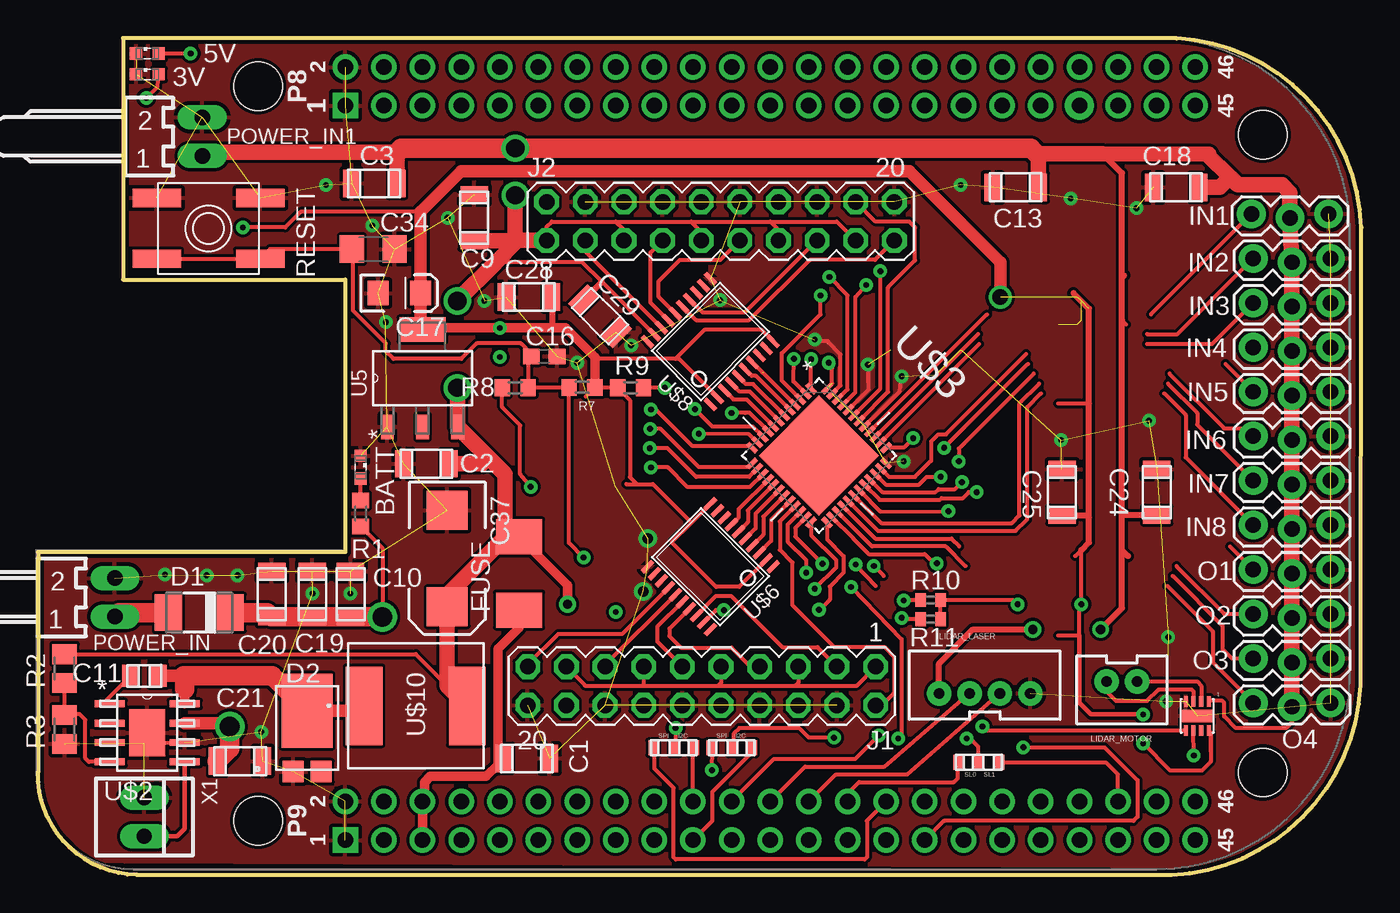
[diagram p5: board, top side]
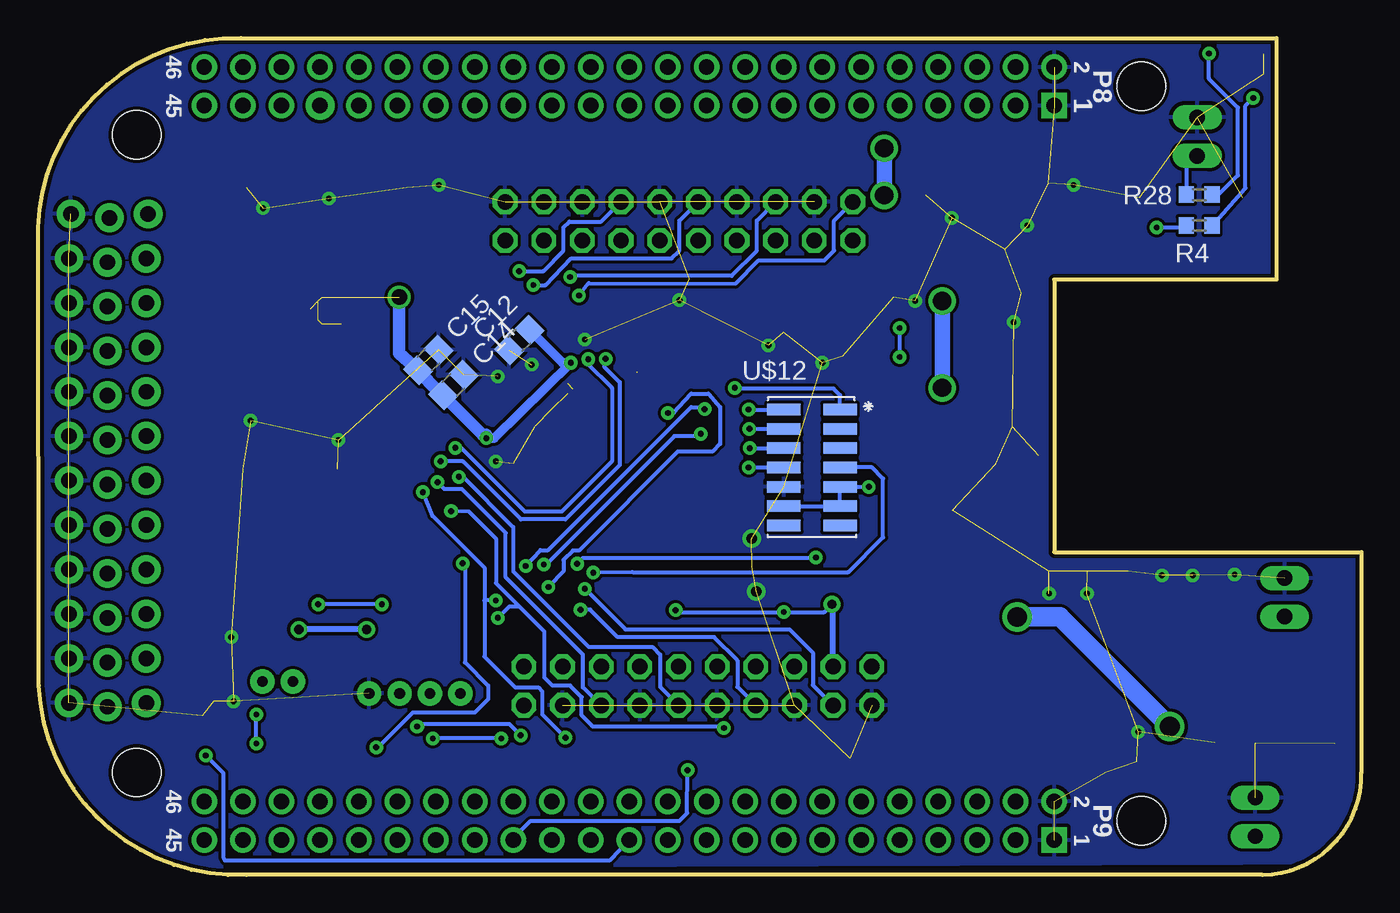
[diagram p6: board, bottom side, seen from below]

Size 87 x 54.99 mm. Coordinates in mm from the lower left corner, seen from the top.
Outline: 0,21.21 0,6.73 arc90 6.5,0 73.3,0 arc90 86.94,12.45 87,42.55 arc90 73.66,54.99 5.59,54.99 5.59,39.12 20.19,39.12 20.19,21.21 0,21.21
Copper layers (1*16): Top 0.035mm / dielectric 1.5mm / Bottom 0.035mm
Design rules "SparkFun *": minimum track width 8mil, minimum drill 15mil, track to track 8mil, track to pad 8mil, pad to pad 4mil, via to via 8mil, smd to smd 8mil, copper to edge 10mil, drill to drill 10mil, minimum pad ring 12mil, minimum via ring 10mil, stop-mask expansion 4mil, vias tented up to drill 25mil, thermal gap 10mil

### Footprints (pad centres in the part's own frame; a part is rotated, then mirrored left to right if it is on the bottom)
LED_SML0603 = smd 0.8 x 0.8: A 0.75,0; C -0.75,0
1206 = smd 1.118 x 1.803: 1 -1.499,0; 2 1.499,0
0805 = smd 1.118 x 1.448: 1 -0.902,0; 2 0.902,0
C0805 = smd 1.3 x 1.5: 1 -0.95,0; 2 0.95,0
C0603 = smd 1.1 x 1: 1 -0.85,0; 2 0.85,0
EIA3216 = smd 1.4 x 1.6: A 1.4,0; C -1.4,0
C1206 = smd 1.6 x 1.8: 1 -1.4,0; 2 1.4,0
EIA7343 = smd 2.55 x 2.7: A 3.17,0; C -3.17,0
DO-214AC = smd 1.8 x 2.4: A 2.025,0; C -2.025,0
POWERDI5 = smd 1.397 x 1.397: 1 -0.92,-2.857; 2 0.92,-2.857 | smd 3.353 x 4.851: 3 0,1.13
1X03_LOCK = drill 1.016 pad 1.88: 1 0,0.127; 2 2.54,-0.127; 3 5.08,0.127
MA10-2 = drill 1.016 octagon: 1 -11.43,-1.27; 2 -11.43,1.27; 3 -8.89,-1.27; 4 -8.89,1.27; 5 -6.35,-1.27; 6 -6.35,1.27; 7 -3.81,-1.27; 8 -3.81,1.27; 9 -1.27,-1.27; 10 -1.27,1.27; 11 1.27,-1.27; 12 1.27,1.27; 13 3.81,-1.27; 14 3.81,1.27; 15 6.35,-1.27; 16 6.35,1.27; 17 8.89,-1.27; 18 8.89,1.27; 19 11.43,-1.27; 20 11.43,1.27
JST-4-PTH-VERT = drill 0.7 pad 1.6: 1 -3,-0.55; 2 -1,-0.55; 3 1,-0.55; 4 3,-0.55
JST-2-PTH-VERT = drill 0.7 pad 1.6: 1 -1,-0.55; 2 1,-0.55
7395-02 = drill 1.016 long: 1 1.27,0; 2 -1.27,0
R0603 = smd 1 x 1.1: 1 -0.85,0; 2 0.85,0
M0805 = smd 1.3 x 1.6: 1 -0.95,0; 2 0.95,0
R0402 = smd 0.7 x 0.9: 1 -0.65,0; 2 0.65,0
EVQ-Q2 = smd 3.2 x 1.2: A -3.4,-2; A' 3.4,-2; B -3.4,2; B' 3.4,2
SPDT = smd 0.66 x 0.965: 1 -0.699,0; 2 0.572,0; 3 1.968,0
SOT230P696X180-4N = smd 1.6 x 0.838: 1 -3.2,2.311; 2 -3.2,0; 3 -3.2,-2.311 | smd 1.6 x 3.023: 4 3.2,0
BEAGLE_BONE_BLACK_CAPE = drill 1.016 pad 1.676 square: P8.1 20.32,50.165; P9.1 20.32,1.905 | drill 1.016 pad 1.676: P8.2 20.32,52.705; P8.3 22.86,50.165; P8.4 22.86,52.705; P8.5 25.4,50.165; P8.6 25.4,52.705; P8.7 27.94,50.165; P8.8 27.94,52.705; P8.9 30.48,50.165; P8.10 30.48,52.705; P8.11 33.02,50.165; P8.12 33.02,52.705; P8.13 35.56,50.165; P8.14 35.56,52.705; P8.15 38.1,50.165; P8.16 38.1,52.705; P8.17 40.64,50.165; P8.18 40.64,52.705; P8.19 43.18,50.165; P8.20 43.18,52.705; P8.21 45.72,50.165; P8.22 45.72,52.705; P8.23 48.26,50.165; P8.24 48.26,52.705; P8.25 50.8,50.165; P8.26 50.8,52.705; P8.27 53.34,50.165; P8.28 53.34,52.705; P8.29 55.88,50.165; P8.30 55.88,52.705; P8.31 58.42,50.165; P8.32 58.42,52.705; P8.33 60.96,50.165; P8.34 60.96,52.705; P8.35 63.5,50.165; P8.36 63.5,52.705; P8.37 66.04,50.165; P8.38 66.04,52.705; P8.40 68.58,52.705; P8.41 71.12,50.165; P8.42 71.12,52.705; P8.43 73.66,50.165; P8.44 73.66,52.705; P8.45 76.2,50.165; P8.46 76.2,52.705; P9.2 20.32,4.445; P9.3 22.86,1.905; P9.4 22.86,4.445; P9.5 25.4,1.905; P9.6 25.4,4.445; P9.7 27.94,1.905; P9.8 27.94,4.445; P9.9 30.48,1.905; P9.10 30.48,4.445; P9.11 33.02,1.905; P9.12 33.02,4.445; P9.13 35.56,1.905; P9.14 35.56,4.445; P9.15 38.1,1.905; P9.16 38.1,4.445; P9.17 40.64,1.905; P9.18 40.64,4.445; P9.19 43.18,1.905; P9.20 43.18,4.445; P9.21 45.72,1.905; P9.22 45.72,4.445; P9.23 48.26,1.905; P9.24 48.26,4.445; P9.25 50.8,1.905; P9.26 50.8,4.445; P9.27 53.34,1.905; P9.28 53.34,4.445; P9.29 55.88,1.905; P9.30 55.88,4.445; P9.31 58.42,1.905; P9.32 58.42,4.445; P9.33 60.96,1.905; P9.34 60.96,4.445; P9.35 63.5,1.905; P9.36 63.5,4.445; P9.37 66.04,1.905; P9.38 66.04,4.445; P9.39 68.58,1.905; P9.40 68.58,4.445; P9.41 71.12,1.905; P9.42 71.12,4.445; P9.43 73.66,1.905; P9.44 73.66,4.445; P9.45 76.2,1.905; P9.46 76.2,4.445 | drill 1.016 pad 1.88: P8.39 68.58,50.165 | hole 3.175: 14.605,3.175; 80.645,6.35; 80.645,48.26; 14.605,51.435
R-PDSO-G8 = smd 1.981 x 0.457: 1 -2.464,1.905; 2 -2.464,0.635; 3 -2.464,-0.635; 4 -2.464,-1.905; 5 2.464,-1.905; 6 2.464,-0.635; 7 2.464,0.635; 8 2.464,1.905 | smd 2.388 x 3.099: 9 0,0
QFN50P700X700X100-49N = smd 0.813 x 0.305: 1 -3.48,2.743; 2 -3.48,2.261; 3 -3.48,1.753; 4 -3.48,1.245; 5 -3.48,0.762; 6 -3.48,0.254; 7 -3.48,-0.254; 8 -3.48,-0.762; 9 -3.48,-1.245; 10 -3.48,-1.753; 11 -3.48,-2.261; 12 -3.48,-2.743; 25 3.48,-2.743; 26 3.48,-2.261; 27 3.48,-1.753; 28 3.48,-1.245; 29 3.48,-0.762; 30 3.48,-0.254; 31 3.48,0.254; 32 3.48,0.762; 33 3.48,1.245; 34 3.48,1.753; 35 3.48,2.261; 36 3.48,2.743 | smd 0.305 x 0.813: 13 -2.743,-3.48; 14 -2.261,-3.48; 15 -1.753,-3.48; 16 -1.245,-3.48; 17 -0.762,-3.48; 18 -0.254,-3.48; 19 0.254,-3.48; 20 0.762,-3.48; 21 1.245,-3.48; 22 1.753,-3.48; 23 2.261,-3.48; 24 2.743,-3.48; 37 2.743,3.48; 38 2.261,3.48; 39 1.753,3.48; 40 1.245,3.48; 41 0.762,3.48; 42 0.254,3.48; 43 -0.254,3.48; 44 -0.762,3.48; 45 -1.245,3.48; 46 -1.753,3.48; 47 -2.261,3.48; 48 -2.743,3.48 | smd 5.588 x 5.588: 49 0,0
DPDT = smd 0.66 x 0.965: 1 -0.699,0; 2 0.572,0; 3 1.968,0; 4 3.111,0; 5 4.381,0; 6 5.779,0
WSON-8 = smd 0.27 x 0.7: 1 0.75,0.95; 2 0.25,0.95; 3 -0.25,0.95; 4 -0.75,0.95; 5 -0.75,-0.95; 6 -0.25,-0.95; 7 0.25,-0.95; 8 0.75,-0.95 | smd 2 x 0.8: PPAD 0,0
TSSOP-20 = smd 0.305 x 0.991: 1 -2.925,-2.918; 2 -2.275,-2.918; 3 -1.625,-2.918; 4 -0.975,-2.918; 5 -0.325,-2.918; 6 0.325,-2.918; 7 0.975,-2.918; 8 1.625,-2.918; 9 2.275,-2.918; 10 2.925,-2.918; 11 2.925,2.918; 12 2.275,2.918; 13 1.625,2.918; 14 0.975,2.918; 15 0.325,2.918; 16 -0.325,2.918; 17 -0.975,2.918; 18 -1.625,2.918; 19 -2.275,2.918; 20 -2.925,2.918
IHLP-3232DZ = smd 2.413 x 5.156: 1 -3.391,0; 2 3.391,0
NANO_FUSE = smd 2.286 x 3.048: 1 -2.413,0; 2 2.413,0
DEBUG_SM = smd 0.76 x 2.2: 1 0,1.85; 2 0,-1.85; 3 1.27,1.85; 4 1.27,-1.85; 5 2.54,1.85; 6 2.54,-1.85; 7 3.81,1.85; 8 3.81,-1.85; 9 5.08,1.85; 10 5.08,-1.85; 11 6.35,1.85; 12 6.35,-1.85; 13 7.62,1.85; 14 7.62,-1.85
22-23-2021 = drill 1 long: 1 -1.27,0; 2 1.27,0

### Placement (x,y rotation side)
3V  7.19,52.6 0 top
5V  7.19,53.98 0 top
BATT  21.21,26.8 270 top
C1  32.13,7.65 0 top
C2  25.53,27.02 180 top
C3  22.1,45.43 180 top
C9  28.67,43.18 90 top
C10  20.54,18.45 270 top
C11  6.99,13.08 0 top
C12  55.36,35.14 225 bottom
C13  64.26,45.18 180 top
C14  59.69,32.18 45 bottom
C15  61.34,33.83 45 bottom
C16  33.27,34.07 0 top
C17  23.75,38.23 0 top
C18  74.8,45.18 180 top
C19  18.03,18.45 270 top
C20  15.37,18.45 270 top
C21  13.28,7.47 180 top
C24  73.53,25.15 270 top
C25  67.31,25.15 270 top
C28  32.26,37.97 0 top
C29  36.94,36.71 135 top
C34  22.03,41.12 0 top
C37  26.89,20.8 270 top
D1  10.6,17.24 180 top
D2  17.68,9.65 0 top
IN1  79.76,43.31 0 top
IN2  79.88,40.39 0 top
IN3  79.88,37.47 0 top
IN4  79.88,34.54 0 top
IN5  79.88,31.62 0 top
IN6  79.88,28.7 0 top
IN7  79.88,25.78 0 top
IN8  79.88,22.86 0 top
J1  43.62,12.41 180 top
J2  44.86,42.96 0 top
LIDAR_LASER  62.23,12.48 0 top
LIDAR_MOTOR  71.25,12.16 180 top
O1  79.88,19.94 0 top
O2  79.88,17.02 0 top
O3  79.88,14.1 0 top
O4  79.88,11.18 0 top
POWER_IN  5.05,18.24 270 top
POWER_IN1  10.79,48.51 270 top
R1  21.21,23.75 270 top
R2  1.75,13.56 90 top
R3  1.74,9.56 90 top
R4  10.67,42.67 180 bottom
R7  35.75,32.04 0 top
R8  31.37,32 0 top
R9  38.96,32 180 top
R10  58.67,18.07 0 top
R11  58.67,16.8 0 top
R28  10.67,44.7 180 bottom
RESET  11.21,42.48 180 top
SPDT  61.21,7.4 0 top
U5  25.27,32.64 90 top
U$1  -0.13,0.38 0 top
U$2  7.18,9.33 0 top
U$3  51.34,27.56 315 top
U$4  46.23,8.35 180 top
U$5  76.2,10.45 0 top
U$6  44.2,20.26 135 top
U$8  44.2,35.05 45 top
U$10  24.83,11.11 0 top
U$11  31.62,19.81 90 top
U$12  36.12,30.58 270 bottom
X1  6.99,3.81 270 top

### Tracks (layer width: path | path; a pad name or v marks a point on that pad's centre or on a via)
+3V3  (via drill 0.38, 1)  (7 unrouted)
  Top 0.254: v57.53,28.7 56.91,28.08 U$3.37 | 52.2,32.3 52.2,33.3 v51.97,33.66 | U$6.2 46.08,18.92 44.58,18.92 41.66,21.84 41.66,21.85 42.95,23.14 | U$8.2 42.12,33.91 41.91,33.91 | 41.91,33.91 36.6,33.91 | 68.19,20.94 68.58,21.34 v68.58,17.78 68.45,17.65 68.45,15.75 67.06,15.75 | R11.2 R10.2 64.1,18.07 v64.39,17.78 | U$8.10 47.57,35.81 43.81,35.81 41.91,33.91 | 67.06,30.99 69.09,30.99 | 25.15,43.56 17.28,43.56 16.26,42.55 v13.46,42.55 | 42.95,23.14 U$6.10 | 35.99,31.43 R7.2 38.08,32.04 R9.2 38.91,31.2 38.91,26.14 39.37,25.68 | 39.37,25.68 40.41,25.68 42.95,23.14 | 38.66,25.68 39.37,25.68 | 77.09,8.13 77.09,7.44 76.51,6.86 74.42,6.86 v72.64,8.64
  Top 0.305: 68.45,15.75 68.45,11.3 69.22,10.54 v72.64,10.54 | 77.09,8.13 77.09,9.36 U$5.8
  Top 0.406: 68.58,21.34 69.09,21.84 69.09,23.5 | 69.09,23.5 69.09,30.99 69.09,37.21 68.07,38.23 | C28.2 33.78,37.97 33.78,35.94 | C25.2 68.94,23.65 69.09,23.5
  Top 0.61: 25.15,35.96 U5.4 25.38,35.94 v30.35,35.94 33.78,35.94 34.67,35.94 36.6,34.01 36.6,33.91 R7.2
  Top 0.813: v63.25,37.97 63.25,40.26 57.28,46.23 27.81,46.23 25.15,43.56 C17.A 25.15,35.96
  Bottom 0.254: v51.97,33.66 52.09,33.66 | v57.53,28.7 57.53,28.92 | C14.1 60.11,31.43 | v30.35,34.04 v30.35,35.94 | v64.39,17.78 v68.58,17.78 | v13.46,42.55 11.9,42.55 R4.2 | v72.64,8.64 v72.64,10.54
  Bottom 0.61: v51.97,33.66 57.02,28.7 v57.53,28.7 | 52.09,33.66 52.53,33.66 C12.1
  Bottom 0.813: v63.25,37.97 63.25,34.29 C15.1 60.69,31.74 C14.1 57.77,28.92 57.53,28.92
+5V  (via drill 0.38, 0.6, 1.2)
  Top 0.254: R2.2 24.83,14.51 U$10.2 | J2.1 33.43,42.58 33.78,42.93 37.97,42.93 | 37.97,42.93 42.93,42.93 | 42.93,42.93 48.13,42.93 | 48.13,42.93 52.52,42.93 J2.17 | J2.5 38.51,42.39 37.97,42.93 | J2.9 43.59,42.26 42.93,42.93 | J2.13 48.67,42.39 48.13,42.93 | 39.88,12.45 35.94,12.45 35.94,12.48 J1.17 | 39.88,12.45 44.7,12.45 | 44.7,12.45 49.78,12.45 | 49.78,12.45 53.82,12.45 J1.1 | J1.5 49.97,12.64 49.78,12.45 | J1.9 44.89,12.64 44.7,12.45 | J1.13 39.81,12.51 39.88,12.45 | U$8.19 37.06,38.97 35.77,40.26 30.1,40.26 | 71.51,36.18 71.25,36.45 | O4.2 82.42,10.03 82.04,9.65 78.74,9.65 77.98,10.41 77.98,11.3 77.85,11.43 76.98,11.43 | U$6.19 44.56,17.4 v45.09,17.4
  Top 0.305: 76.98,11.43 U$5.1 | 32.13,21.72 U$11.2
  Top 0.406: 71.25,39.24 71.25,36.45 71.25,23.62 | 71.25,39.24 71.25,46.12 69.98,47.39 | 71.64,20.94 71.25,21.34 | 71.25,21.34 71.25,23.62 | LIDAR_LASER.1 59.23,13.89 61.47,16.13 v65.41,16.13 | v69.85,16.13 71.25,17.53 71.25,21.34 | C29.2 35.88,37.78 37.06,38.97 | C24.2 71.27,23.65 71.25,23.62 | 71.4,39.4 71.25,39.24
  Top 0.61: 27.58,31.98 v27.56,32 | 82.42,41.91 IN1.2 | 31.37,41.53 31.53,41.69 | O4.2 82.42,12.83 | POWER_IN1.1 11.05,47.5 | 30.7,22.26 30.73,22.23 | v34.8,17.78 34.8,19.05 U$11.2
  Top 1.016: U$10.2 26.89,12.44 C37.A 26.89,18.38 30.73,22.23 U$11.2 | 29.59,27.43 U5.3 27.58,31.98 | 29.59,27.43 30.7,26.32 30.7,22.26 | 31.53,41.69 J2.1 | O4.2 O3.2 O2.2 O1.2 IN8.2 IN7.2 IN6.2 IN5.2 IN4.2 IN3.2 IN2.2 IN1.2 82.3,44.83 81.79,45.34 78.87,45.34 78.36,45.85 | v27.56,37.72 30.1,40.26 31.37,41.53 31.37,41.78 | 31.37,41.78 v31.37,44.65 | 76.84,47.37 69.98,47.39 65.91,47.4 65.76,47.25 C13.1 | 76.84,47.37 76.96,47.37 | 11.05,47.5 23.62,47.5 23.6,47.47 C3.1 | C2.1 29.18,27.02 29.59,27.43 | 78.36,45.85 76.84,47.37 | C18.1 77.69,45.18 78.36,45.85 | C9.1 31.27,41.68 31.37,41.78
  Top 1.27: 23.62,47.5 23.88,47.75 v31.37,47.75 65.26,47.75 65.76,47.25
  Bottom 0.254: POWER_IN1.1 11.52,46.52 R28.2 | v34.8,17.78 35.31,17.27 37.87,17.27 v37.97,17.27 44.96,17.27 v45.09,17.4 44.93,17.4
  Bottom 0.406: v65.41,16.13 v69.85,16.13 | J1.17 34.73,17.72 v34.8,17.78
  Bottom 1.016: v27.56,32 v27.56,37.72 | v31.37,44.65 v31.37,47.75
BOOT12
  Top 0.254: U$2.1 4.52,11.52 C11.1
ECHO_1
  Top 0.254: U$6.18 44.58,18.34 45.54,18.34 48.92,14.96 51.24,14.96 J1.3
ECHO_2
  Top 0.254: J1.7 46.84,13.68 45.59,14.94 42.27,14.94 41.5,15.7 41.5,16.18 U$6.17
ECHO_3
  Top 0.254: U$6.16 40.69,16.29 40.69,15.34 J1.11
ECHO_4
  Top 0.254: U$6.15 37.27,13.79 J1.15
ECHO_5
  Top 0.254: U$6.14 38.38,15.82 34.19,15.82 32.2,13.83 J1.19
ECHO_6
  Top 0.254: U$8.18 35.97,40.98 J2.3
ECHO_7
  Top 0.254: U$8.17 40.26,37.61 40.26,40.89 J2.7
ECHO_8
  Top 0.254: U$8.16 40.79,38 40.79,39.01 42.19,40.41 44.86,40.41 J2.11
ECHO_9
  Top 0.254: J2.15 46.48,36.96 43.69,36.96 42.84,37.8 U$8.14
ECHO_10
  Top 0.254: J2.19 55.02,40.41 50.75,40.41 46.74,36.45 43.26,36.45 U$8.15
GND  (via drill 0.38, 0.7)  (92 unrouted)
  Top 0.254: U$2.6 6.99,8.64 | U$3.41 56.64,31.78 v56.77,32.77 | U$3.44 54.61,31.91 v54.55,33.53 | v51.05,35.18 51.18,35.05 51.94,35.05 51.94,35 52.76,34.19 52.76,32.17 U$3.47
  Top 1.016: U$2.9 6.99,8.64
  other vias: 56.9,27.18 44.83,37.77 73.03,29.84 74.3,15.62 38.99,34.8 29.34,37.72 67.88,44.45 72.2,43.81 67.25,28.57 60.64,45.34 74.14,11.4 26.92,43.18 14.67,9.4 21.97,42.67 22.86,36.32 18.92,45.34 35.43,33.66 40.08,22.1 39.78,18.62 8.34,19.74 11.09,19.68 18.05,18.49 20.54,18.49 13.12,19.68
  pour Top: 84.93,0.51 -1.56,0.89 -1.56,62.17 91.28,61.79 91.28,0.32 85.92,0.32 85.92,0.54 85.6,0.54 85.6,0.51
  pour Bottom: 91.59,0.51 -1.5,0.84 -1.52,62.94 91.57,62.61
LDS_RX
  Top 0.254: U$1.P9.24 50.42,7.11 55.65,7.11 LIDAR_LASER.2
LDS_TX
  Top 0.254: U$1.P9.26 52.45,6.6 57.14,6.6 LIDAR_LASER.3
LIDAR_DIR  (via drill 0.38)
  Top 0.254: v75.97,7.85 U$5.6
  Bottom 0.254: U$1.P9.23 49.43,0.94 74.7,0.94 74.8,1.14 74.8,6.68 v75.97,7.85
LIDAR_OUT1
  Top 0.254: LIDAR_MOTOR.1 76.19,12.71 76.45,12.45 U$5.2
LIDAR_OUT2
  Top 0.254: LIDAR_MOTOR.2 70.25,12.05 70.87,11.43 72.9,11.43 73.66,12.19 75.82,12.19 75.95,12.06 U$5.3
LIDAR_PWM  (via drill 0.38)
  Top 0.254: U$1.P9.22 48.39,7.62 53.72,7.62 v55.27,9.17 | v62.08,9.75 62.39,9.5 U$5.5
  Bottom 0.254: v55.27,9.17 56.01,9.91 61.92,9.91 v62.08,9.75
MCU_ECHO1
  Top 0.254: U$3.20 48.18,23.32 48.18,21.95 U$6.3
MCU_ECHO2
  Top 0.254: U$3.19 47.68,23.54 47.68,22.36 U$6.4
MCU_ECHO3
  Top 0.254: U$3.18 47.17,23.75 47.17,22.77 U$6.5
MCU_ECHO4
  Top 0.254: U$3.17 46.66,23.96 46.66,23.18 U$6.6
MCU_ECHO5
  Top 0.254: U$3.16 46.08,24.05 46.08,23.52 U$6.7
MCU_ECHO6
  Top 0.254: U$3.8 46.58,31.24 45.71,31.24 U$8.3
MCU_ECHO7
  Top 0.254: U$3.7 46.79,31.75 46.12,31.75 U$8.4
MCU_ECHO8
  Top 0.254: U$3.6 47,32.26 46.53,32.26 U$8.5
MCU_ECHO9
  Top 0.254: U$3.5 47.18,32.79 46.92,32.79 U$8.6
MCU_ECHO10  (1 unrouted)
  Top 0.254: U$3.4 47.65,33.01 | 47.61,33.02 U$8.7
N$1
  Top 0.305: U$2.5 9.64,3.04 9.14,2.54 X1.2
N$2
  Top 0.61: U$11.1 31.62,16.26 30.23,14.86 30.23,8.06 | 30.23,8.06 C1.1 | 30.23,8.06 30.23,7.24 29.46,6.48 25.78,6.48 25.4,6.1 25.4,4.95 U$1.P9.6 U$1.P9.5
N$3
  Top 0.813: 8.42,17.4 D1.A
  Top 1.27: POWER_IN.1 5.33,17.24 D1.A
N$4
  Top 0.254: R1.1 BATT.A
N$5  (via drill 0.38)
  Top 0.254: 7.99,52.45 3V.A 7.86,51.8 v7.11,51.05
  Bottom 0.254: R4.1 7.62,45.12 7.62,50.55 v7.11,51.05
N$8  (via drill 0.38)
  Top 0.254: v32.38,25.5 31.7,26.34 31.7,29.54 30.51,30.73 30.51,31.99 R8.1
  Bottom 0.254: U$12.12 U$12.11 U$12.9 v32.38,25.5
N$9  (via drill 0.38)
  Top 0.254: 39.78,31.62 39.78,31.97 R9.1 v41.2,32
  Bottom 0.254: U$12.1 34.27,31.53 34.7,31.95 41.15,31.95 v41.2,32
N$10  (via drill 0.38)
  Top 0.254: v10.03,53.98 5V.A
  Bottom 0.254: R28.1 9.4,44.7 8.13,45.97 8.13,50.42 10.03,52.32 v10.03,53.98
PH
  Top 0.61: 9.65,12.19 9.65,11.25 U$2.8
  Top 0.813: C11.2 9.59,13.08 9.64,13.03 | D2.3 21.11,10.78 U$10.1
  Top 1.27: 9.59,13.08 15.39,13.08 D2.3 | 9.64,13.03 9.64,12.21 9.65,12.19
PWM_C1  (via drill 0.38)
  Top 0.254: v59.56,28.07 65.08,33.58 | U$3.1 v50.82,33.88
  Bottom 0.254: v50.82,33.88 50.93,33.66 49.28,32 49.28,27.18 52.58,23.88 54.99,23.88 59.18,28.07 v59.56,28.07
PWM_C2  (via drill 0.38)
  Top 0.254: v49.68,33.91 49.66,32.46 49.66,32.44 U$3.2 | 65.45,32.93 60.53,28.02 v60.53,27.18
  Bottom 0.254: v60.53,27.18 59.05,27.18 55.24,23.37 52.32,23.37 48.77,26.92 48.77,32.38 49.78,33.4 v49.68,33.91
PWM_C3
  Top 0.254: U$3.30 55.43,23.11 64.01,23.11 64.52,23.62 64.52,30.99 65.81,32.28
PWM_C4
  Top 0.254: U$3.29 55.21,22.61 64.26,22.61 65.02,23.37 65.02,30.73 65.92,31.63
PWM_C5
  Top 0.254: U$3.28 55.04,22.1 60.05,22.1 60.55,21.59
PWM_C6
  Top 0.254: U$3.27 54.83,21.59 59.66,21.59 60.96,20.29
PWM_C7  (via drill 0.38)
  Top 0.254: 55.59,19.64 v54.94,20.3 | v43.18,30.61 44.32,29.46 46.99,29.46 47.64,28.81 U$3.10
  Bottom 0.254: v54.94,20.3 53.97,21.34 53.47,21.34 44.07,30.73 43.31,30.73 v43.18,30.61
PWM_C8  (via drill 0.38)
  Top 0.254: v53.75,20.4 55.05,18.99 | v43.43,28.98 46.75,28.96 U$3.11
  Bottom 0.254: v43.43,28.98 43.69,28.83 45.16,28.83 53.59,20.4 v53.75,20.4
PWM_C9
  Top 0.254: U$3.35 55.93,26.16 57.66,26.16 58.7,27.2 58.7,28.47 59.18,28.96 59.69,28.96 64.97,34.23
PWM_C10
  Top 0.254: U$3.38 61.86,34.88
PWM_C11
  Top 0.254: U$3.39 61.79,35.53
PWM_C12
  Top 0.254: U$3.40 62.38,36.83
PWM_IN_1
  Top 0.254: 73.16,36.83 IN1.1
PWM_IN_2
  Top 0.254: 72.9,35.53 74.9,35.53 IN2.1
PWM_IN_3
  Top 0.254: 72.9,34.89 77.18,34.89 IN3.1
PWM_IN_4
  Top 0.254: 79.69,34.23 IN4.1
PWM_IN_5
  Top 0.254: 78.05,33.58 IN5.1
PWM_IN_6
  Top 0.254: 74.38,32.93 77.98,29.34 79.38,29.34 IN6.1
PWM_IN_7
  Top 0.254: 74.27,32.28 76.2,30.35 76.2,29.59 IN7.1
PWM_IN_8
  Top 0.254: 74.03,31.63 75.44,30.23 75.44,27.43 IN8.1
PWM_OUT_1
  Top 0.254: 78.36,21.59 O1.1
PWM_OUT_2
  Top 0.254: 74.83,20.29 77.98,17.14 O2.1
PWM_OUT_3
  Top 0.254: 74.59,19.64 77.85,16.38 77.85,14.86 78.49,14.22 O3.1
PWM_OUT_4
  Top 0.254: 74.22,18.99 77.22,16 77.22,13.97 O4.1
RESET  (via drill 0.38)
  Top 0.254: RESET.B' RESET.B | U$3.23 49.78,22.81 49.78,22.23 v51.56,20.45 | 34.87,32 34.67,31.81 | 14.64,40.45 RESET.B | RESET.B 15.24,41.12 C34.1 20.7,41.05 20.7,37.08 22.86,34.92 22.86,34.42 23.37,33.91 27.81,33.91 28.83,34.92 31.75,34.92 32.42,34.25 C16.1 32.22,33.86 R8.2 34.87,32 | 34.87,32 R7.1 34.9,21.82 v35.86,20.85
  Bottom 0.254: v51.56,20.45 51.18,20.83 v35.86,20.85
SCL
  Top 0.254: U$1.P9.19 44.32,3.56 44.32,5.46 46.93,8.06 U$4.1 46.86,8.29
SDA
  Top 0.254: U$1.P9.20 43.05,8.29 U$4.4
SIMO
  Top 0.254: U$1.P9.30 54.48,3.56 54.48,1.14 54.36,1.02 41.91,1.02 41.78,1.14 41.78,5.71 40.51,6.99 40.51,8.29 U$4.6
SIMO/SDA  (via drill 0.38)
  Top 0.254: U$3.31 55.38,23.88 v59.84,23.9 | v41.91,9.65 41.91,8.41 U$4.5 | R11.1 56.86,16.8 v56.77,16.89
  Bottom 0.254: v41.91,9.65 42.04,9.78 50.57,9.78 50.6,9.8 50.6,9.83 51.26,10.49 51.26,11.68 52.02,12.45 53.19,12.45 53.72,12.98 53.72,16 55.37,17.65 | 55.37,17.65 56.9,19.18 56.9,22.1 58.67,23.88 v59.84,23.9 | v56.77,16.89 56.01,17.65 55.37,17.65
SOMI  (via drill 0.38)
  Top 0.254: v44.3,6.88 44.32,8.29 U$4.3
  Bottom 0.254: U$1.P9.29 55.75,2.41 54.61,3.56 44.83,3.56 44.32,4.06 v44.3,6.88
SOMI/SCL  (via drill 0.38)
  Top 0.254: U$3.32 55.34,24.64 59.28,24.64 59.41,24.77 60.81,24.77 61.19,25.15 v61.7,25.15 | v52.32,9.02 50.67,9.02 50.04,9.65 46.1,9.65 45.72,9.27 45.72,8.41 U$4.2 | R10.1 57.99,18.03 v56.9,18.03
  Bottom 0.254: v52.32,9.02 53.85,10.54 53.85,12.06 54.1,12.32 55.63,12.32 57.66,14.35 57.66,18.03 | 57.66,18.03 57.66,20.19 61.06,23.6 v61.7,25.15 | v56.9,18.03 57.66,18.03
SPI_CLK  (via drill 0.38)
  Top 0.254: U$3.26 53.59,22.11 53.59,22.1 54.61,21.08 58.29,21.08 58.9,20.47 v59.08,20.47 | v64.77,8.38 70.1,8.38 72.26,6.22 72.26,3.81 72.01,3.56 59.56,3.56 U$1.P9.31
  Bottom 0.254: v64.77,8.38 64.64,8.38 62.36,10.67 58.29,10.67 57.4,11.56 57.4,12.45 58.93,13.97 58.93,20.32 v59.08,20.47
SPI_SL  (via drill 0.38)
  Top 0.254: v53.44,18.92 56.77,15.49 56.77,9.2 v56.54,8.97 | SPDT.2 61.79,8.45 61.27,8.97 v61.04,8.97 | U$3.9 46.76,30.38 46.51,30.38 46.48,30.35 v45.59,30.35
  Bottom 0.254: v56.54,8.97 v61.04,8.97 | v53.44,18.92 52.45,19.94 52.45,20.7 51.84,21.31 51.43,21.31 44.96,27.81 42.67,27.81 42.16,28.32 42.16,30.73 42.93,31.62 44.07,31.62 45.21,30.35 v45.59,30.35
SPI_SL0
  Top 0.254: U$1.P9.28 53.21,5.33 53.97,6.1 60.2,6.1 60.45,6.35 60.45,7.33 SPDT.1
SPI_SL1
  Top 0.254: U$1.P9.42 70.99,6.6 70.23,7.37 63.21,7.37 SPDT.3
TCK  (via drill 0.38)
  Top 0.254: U$3.15 46.78,25.48 42.7,25.48 41.4,26.77 v40.28,26.77
  Bottom 0.254: v40.28,26.77 U$12.8
TDI  (via drill 0.38)
  Top 0.254: U$3.13 46.7,26.8 43.43,26.8 40.92,29.31 v40.23,29.31
  Bottom 0.254: v40.23,29.31 U$12.4
TDO  (via drill 0.38)
  Top 0.254: U$3.12 46.85,28.17 43.03,28.17 40.61,30.58 v40.28,30.58
  Bottom 0.254: v40.28,30.58 U$12.2
TEST  (via drill 0.38)
  Top 0.254: U$3.22 49.28,23.02 49.28,21.89 50.49,20.7 v50.49,19.86
  Bottom 0.254: v50.49,19.86 47.93,19.89 33.73,19.89 31.45,22.17 31.45,26.04 32.18,26.77 U$12.7 34.24,26.75
TMS  (via drill 0.38)
  Top 0.254: U$3.14 46.75,26.16 43.26,26.16 41.38,28.04 v40.21,28.04
  Bottom 0.254: v40.21,28.04 U$12.6
TRIG_1
  Top 0.254: U$3.21 48.77,23.23 48.77,21.36 49.61,20.52 49.61,17.7 52.32,14.99 55.63,14.99 56.26,14.35 56.26,11.94 55.47,11.14 J1.2
TRIG_2  (via drill 0.38)
  Top 0.254: U$3.33 55.51,25.15 59,25.15 59.21,25.35 60.27,25.35 v60.73,25.81
  Bottom 0.254: J1.6 50.01,11.14 51.18,12.32 51.18,14.48 56.26,19.56 56.26,22.48 59.13,25.35 60.27,25.35 v60.73,25.81
TRIG_3  (via drill 0.38)
  Top 0.254: U$3.34 55.72,25.65 57.91,25.65 58.42,26.16 v59.33,26.16
  Bottom 0.254: J1.10 46.1,12.35 46.1,14.48 46.61,14.99 50.8,14.99 55.75,19.94 55.75,22.86 59.05,26.16 v59.33,26.16
TRIG_4  (via drill 0.38)
  Top 0.254: U$3.25 51.86,22.05 52.96,20.96 52.96,19.86 52.04,18.95 52.04,18.09 51.38,17.42 v51.33,17.42
  Bottom 0.254: J1.14 41.02,12.35 41.02,14.1 42.54,15.62 48.89,15.62 50.7,17.42 v51.33,17.42
TRIG_5  (via drill 0.38)
  Top 0.254: U$3.24 50.82,22.33 52.45,20.7 52.45,20.19 v51.05,18.8
  Bottom 0.254: J1.18 36.07,12.48 36.07,14.61 37.59,16.13 48.39,16.13 v51.05,18.8
TRIG_6  (via drill 0.38)
  Top 0.254: U$3.3 48.89,32.48 48.89,34.29 51.43,36.83 v51.43,38.08
  Bottom 0.254: v51.43,38.08 50.8,38.89 41.15,38.86 39.62,40.39 35.31,40.39 34.67,41.02 34.67,42.99 J2.2
TRIG_7  (via drill 0.38)
  Top 0.254: U$3.46 53.21,31.91 53.21,38.08 v52.02,39.29
  Bottom 0.254: J2.6 39.75,42.99 39.75,41.02 41.4,39.37 51.94,39.37 v52.02,39.29
TRIG_8  (via drill 0.38)
  Top 0.254: U$3.45 53.72,31.7 53.72,37.97 v54.43,38.76
  Bottom 0.254: v54.43,38.76 53.64,38.76 51.94,40.51 45.34,40.51 44.83,41.02 44.83,42.99 J2.10
TRIG_9  (via drill 0.38)
  Top 0.254: U$3.43 55.37,31.95 v55.37,39.67
  Bottom 0.254: v55.37,39.67 53.77,39.67 52.45,41.02 52.45,42.55 52.07,42.93 49.97,42.93 J2.14
TRIG_10
  Top 0.254: U$3.42 55.88,31.74 55.88,38.61 57.66,40.39 57.66,42.55 57.28,42.93 55.05,42.93 J2.18
VCC  (via drill 1.3)
  Top 0.254: R1.2 22.64,21.47 v22.64,16.95
  Top 0.813: 12.38,9.97 U$2.7 | 12.67,9.68 v12.6,9.75 | v22.63,16.95 v22.64,16.95 | 15.07,17.24 C20.2
  Top 1.27: 12.38,9.97 v12.6,9.75 12.6,8.29 C21.2 | v22.63,16.95 C10.2 C19.2 C20.2 | D1.C 15.07,17.24
  Bottom 1.27: v22.64,16.95 19.81,16.95 v12.6,9.75
VSNS12
  Top 0.254: R2.1 R3.2 1.78,10.57 2.73,10.57 3.11,10.19 3.11,7.65 3.33,7.43 U$2.4